# EasyEDA Pro project modular_design_320320LCD.eprj

# Schematic Schematic1

## Sheets
1 P0_MCU_extend: Board Name: Board1; Create Date: 2026-06-22; Page Name: P0_MCU_extend; Project Name: modular_design; Schematic Name: Schematic1; Update Date: 2026-07-06; Add into BOM: yes; Company: 嘉立创EDA; Convert to PCB: yes; Page Size: A4; Version: V1.0
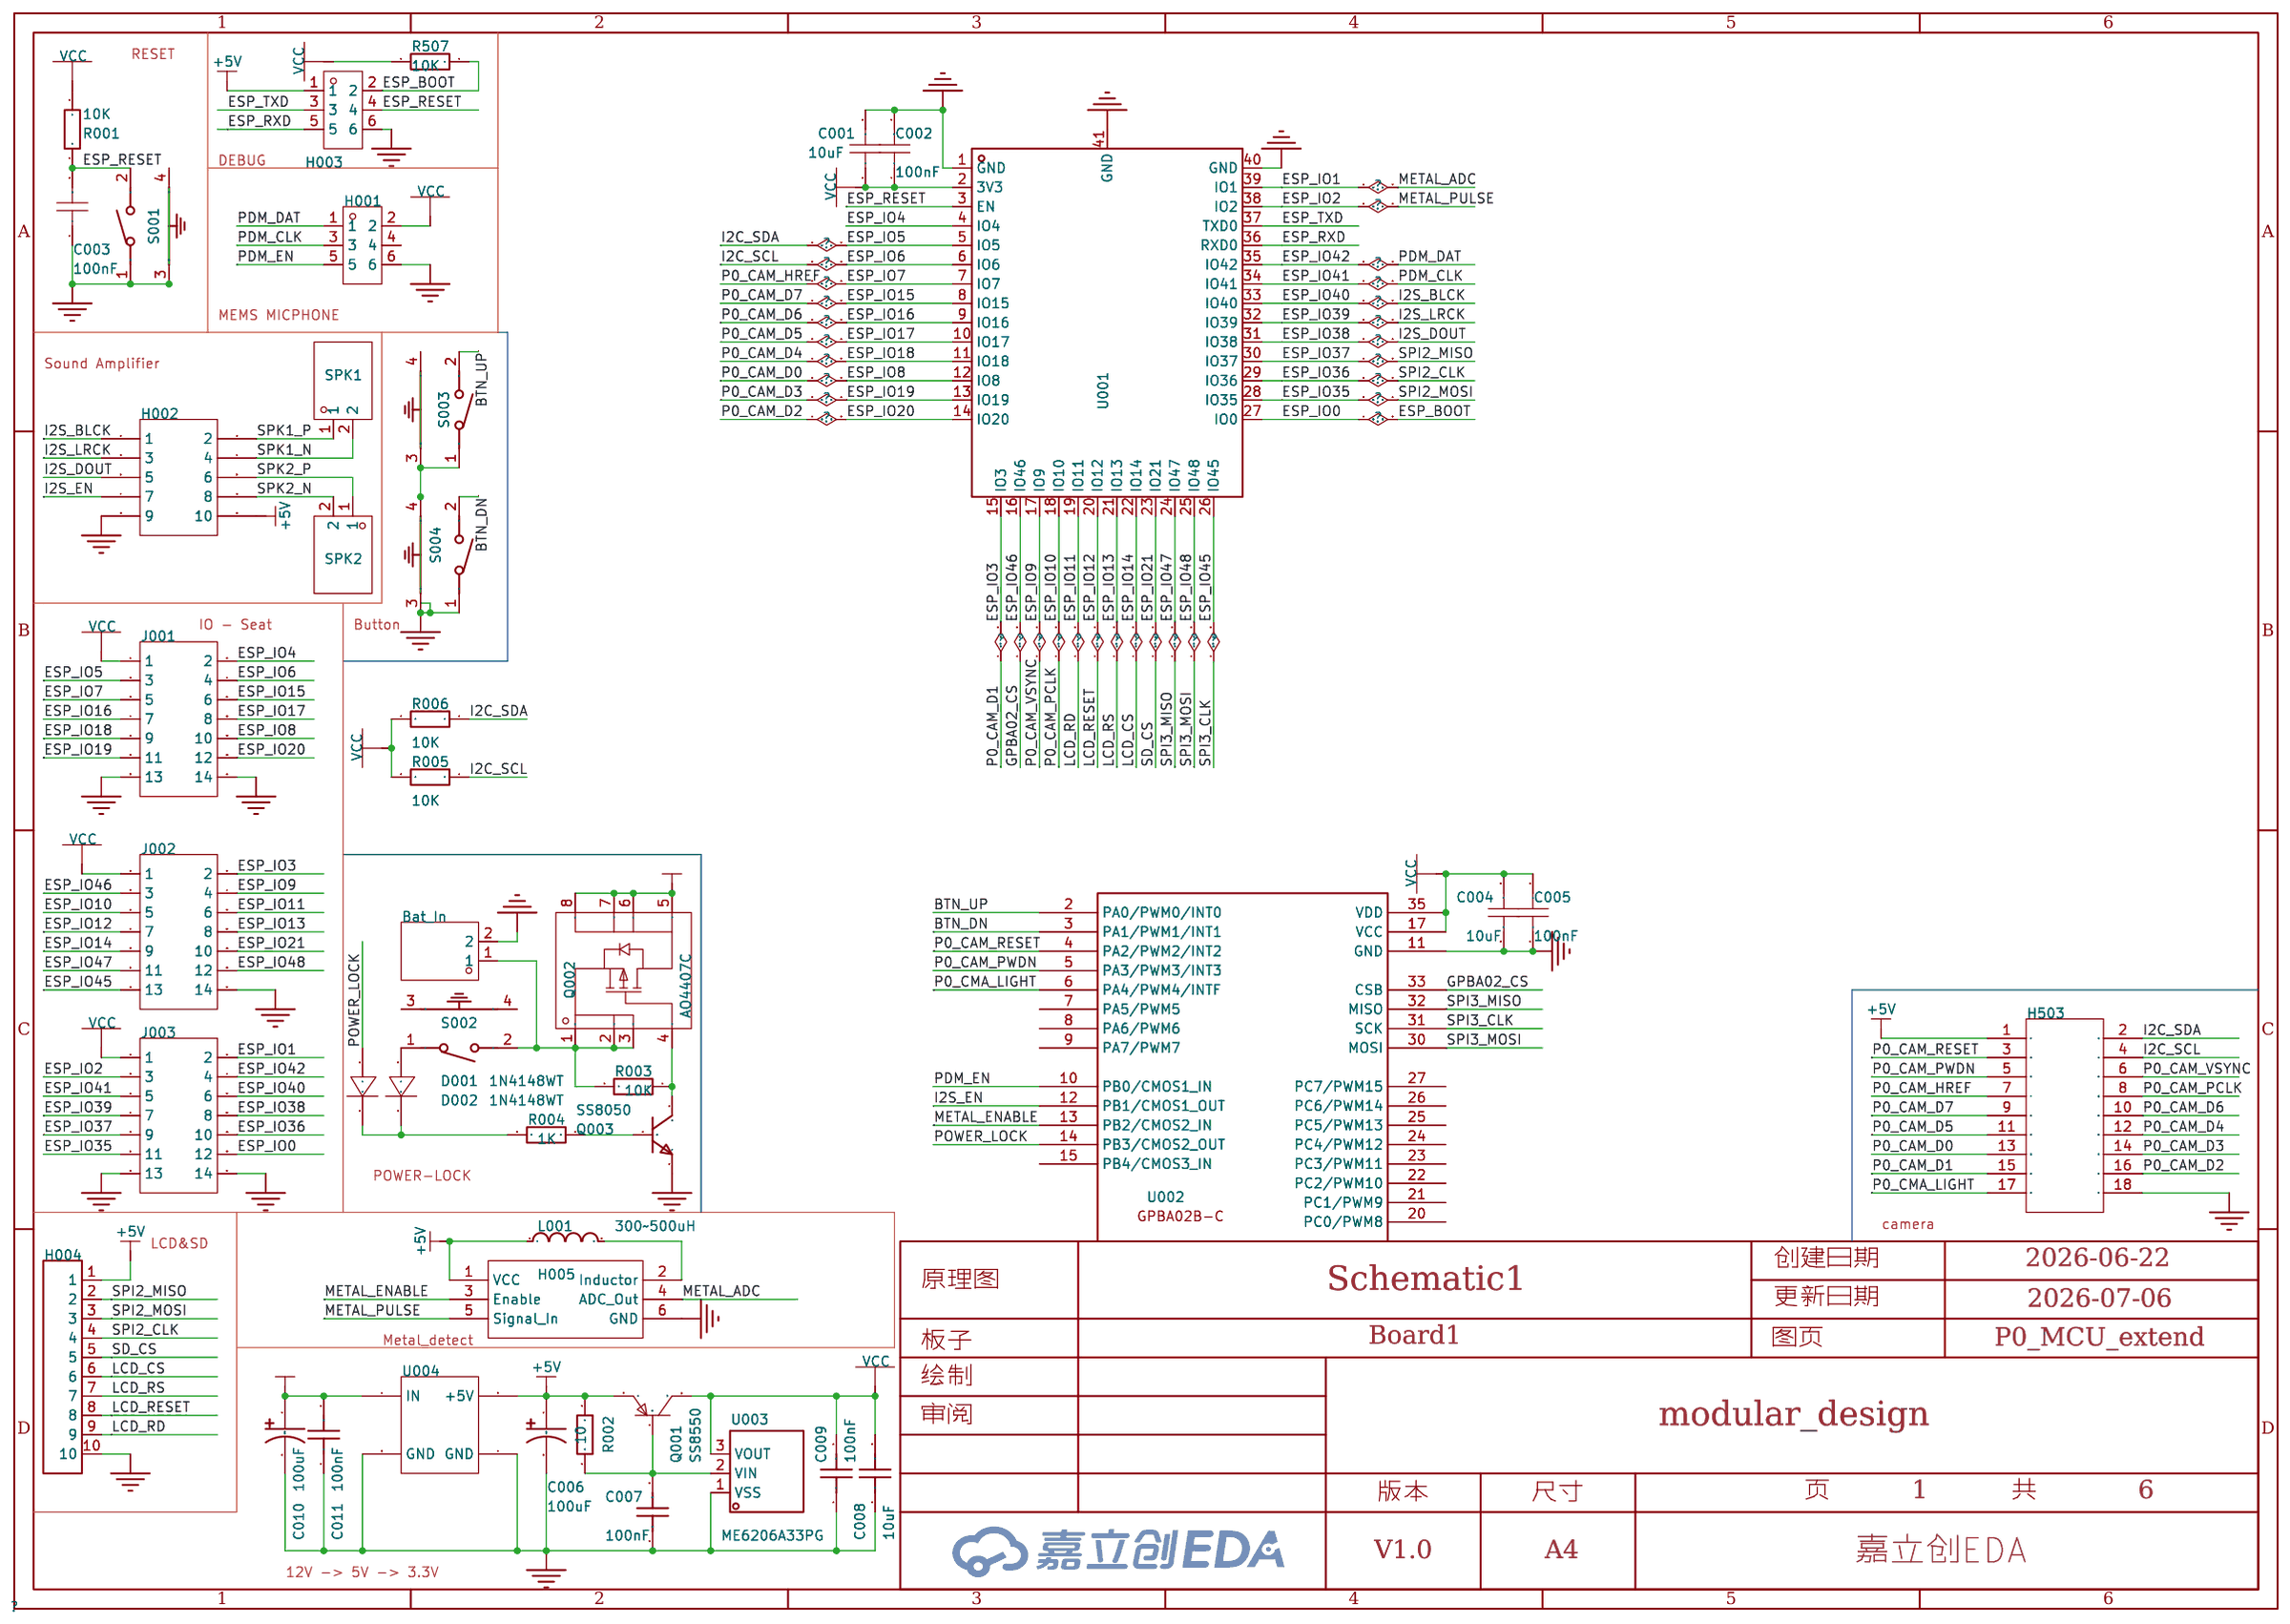
[diagram p0: P0_MCU_extend]
2 P1_mic_amp: Create Date: 2026-06-24; Page Name: P1_mic_amp; Update Date: 2026-06-26
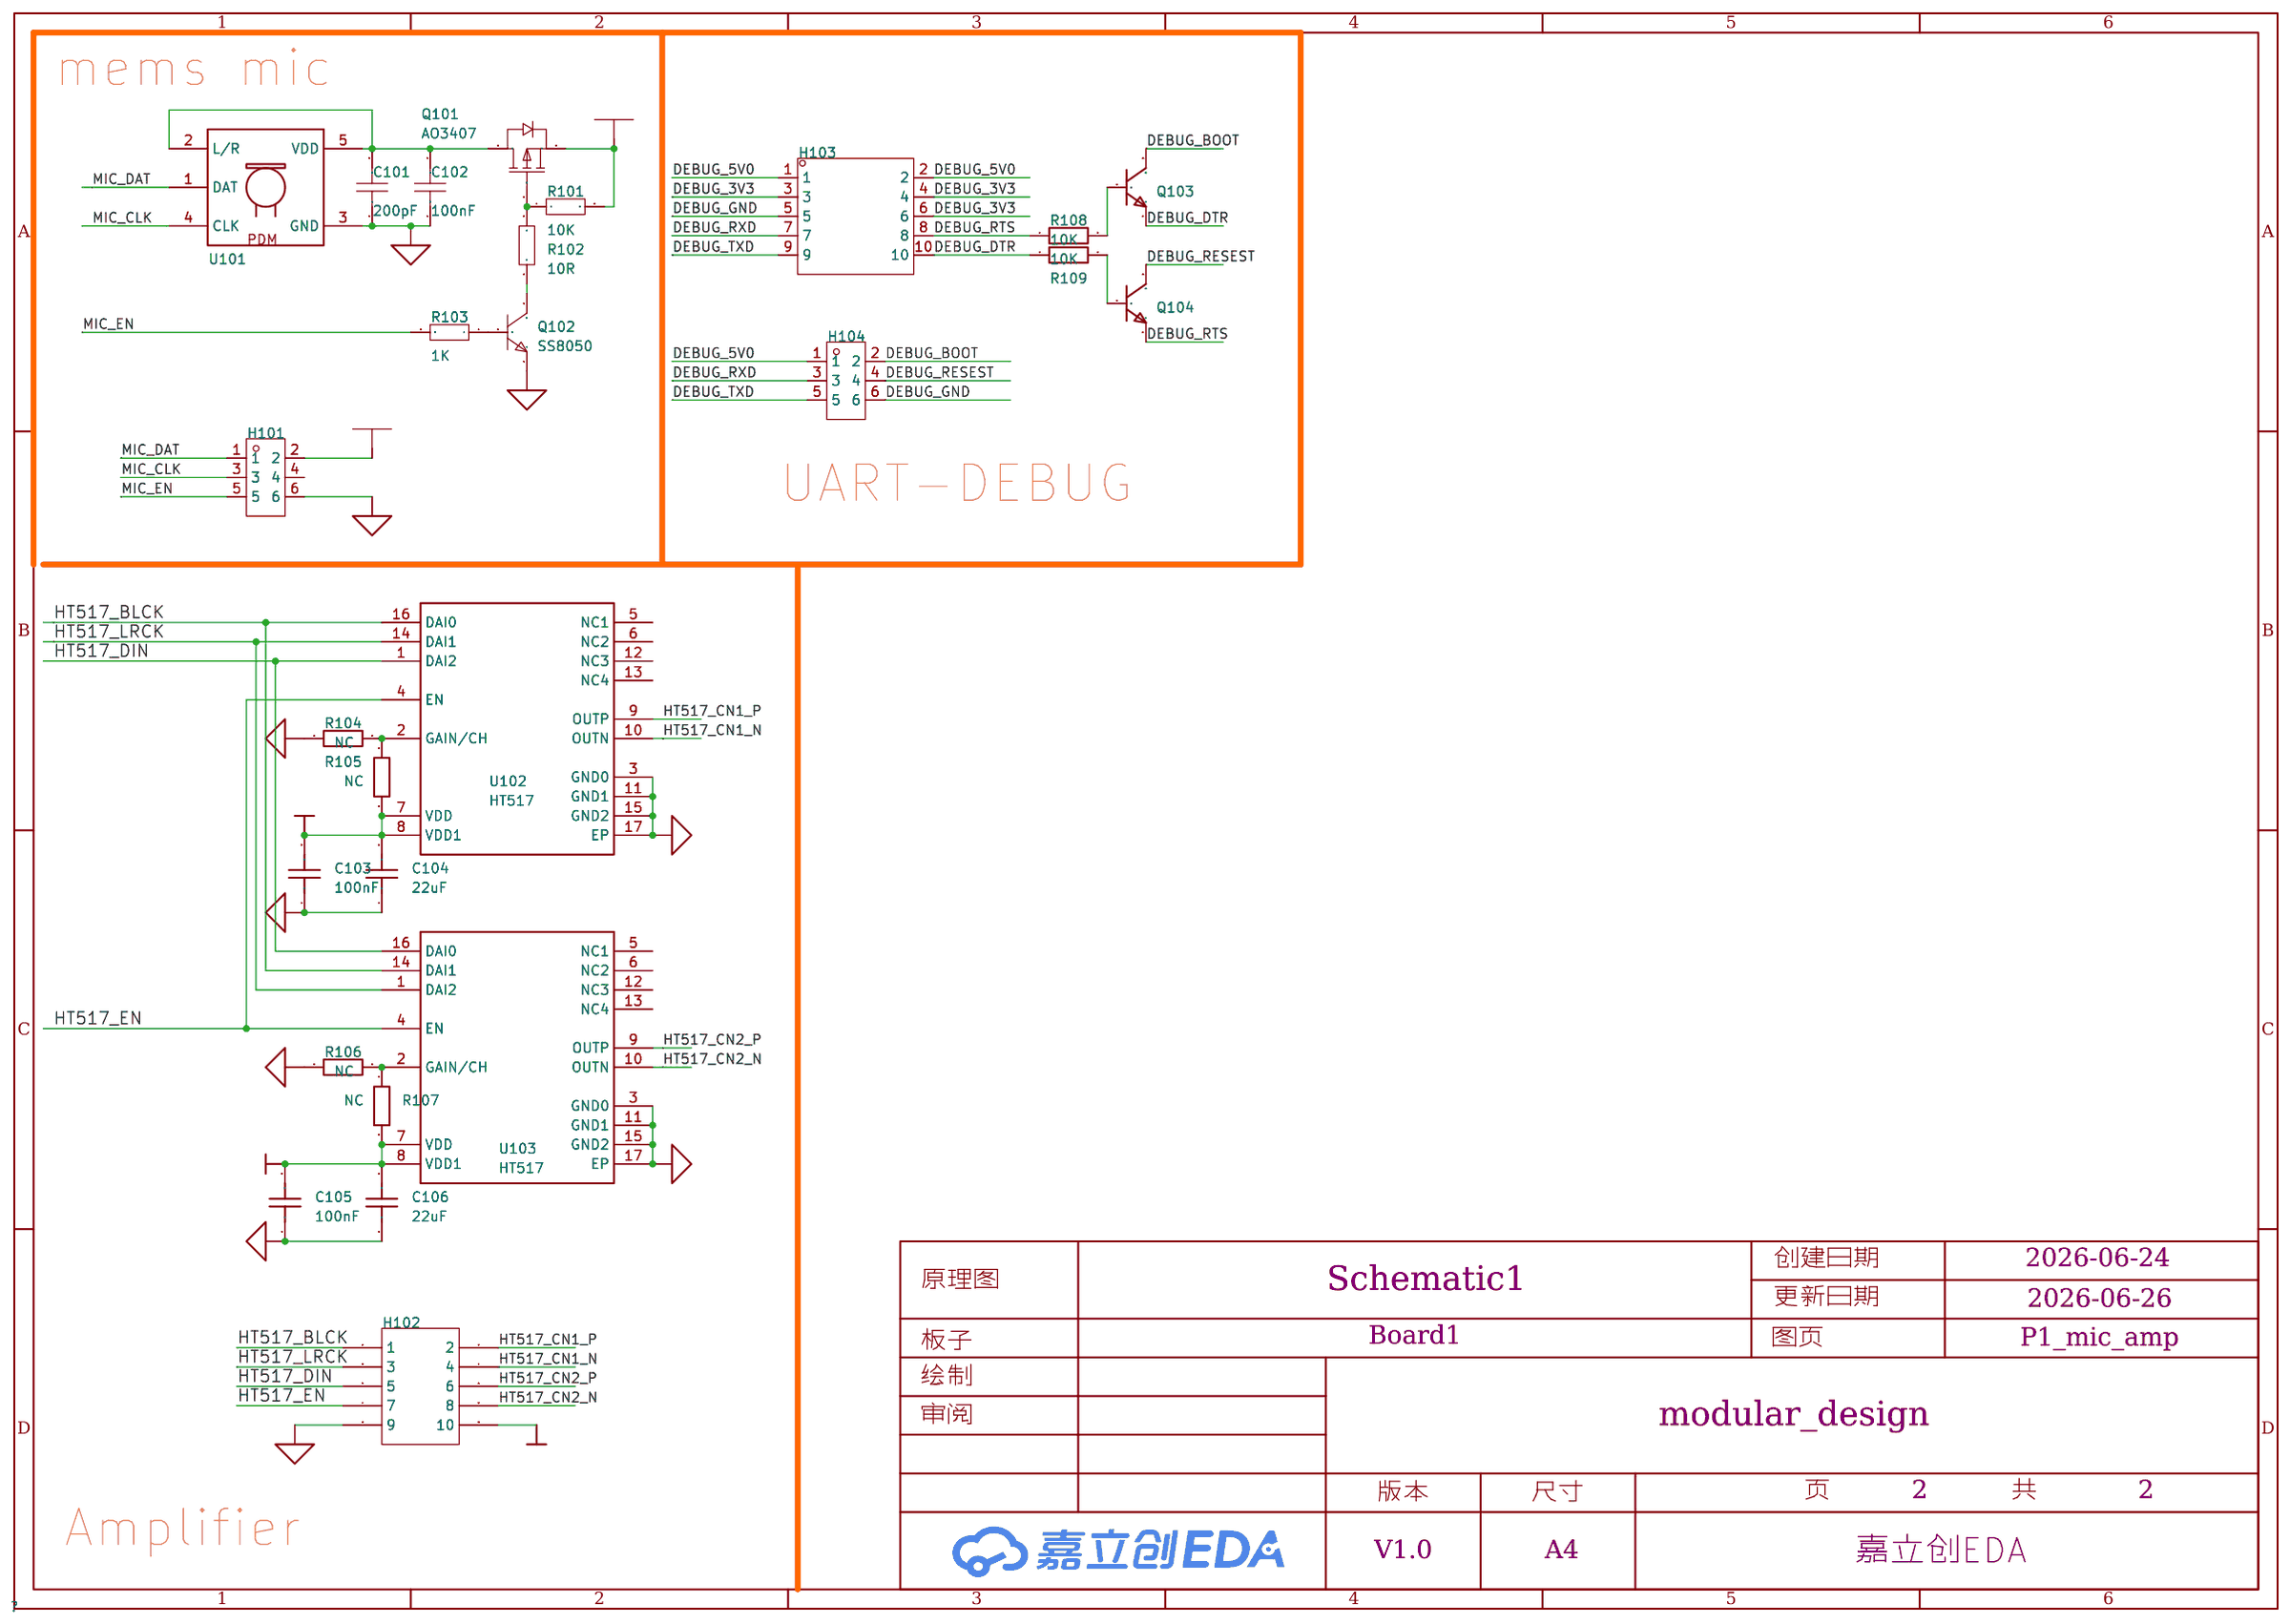
[diagram p1: P1_mic_amp]
3 P2_LCD_SD: Create Date: 2026-06-30; Page Name: P2_LCD_SD
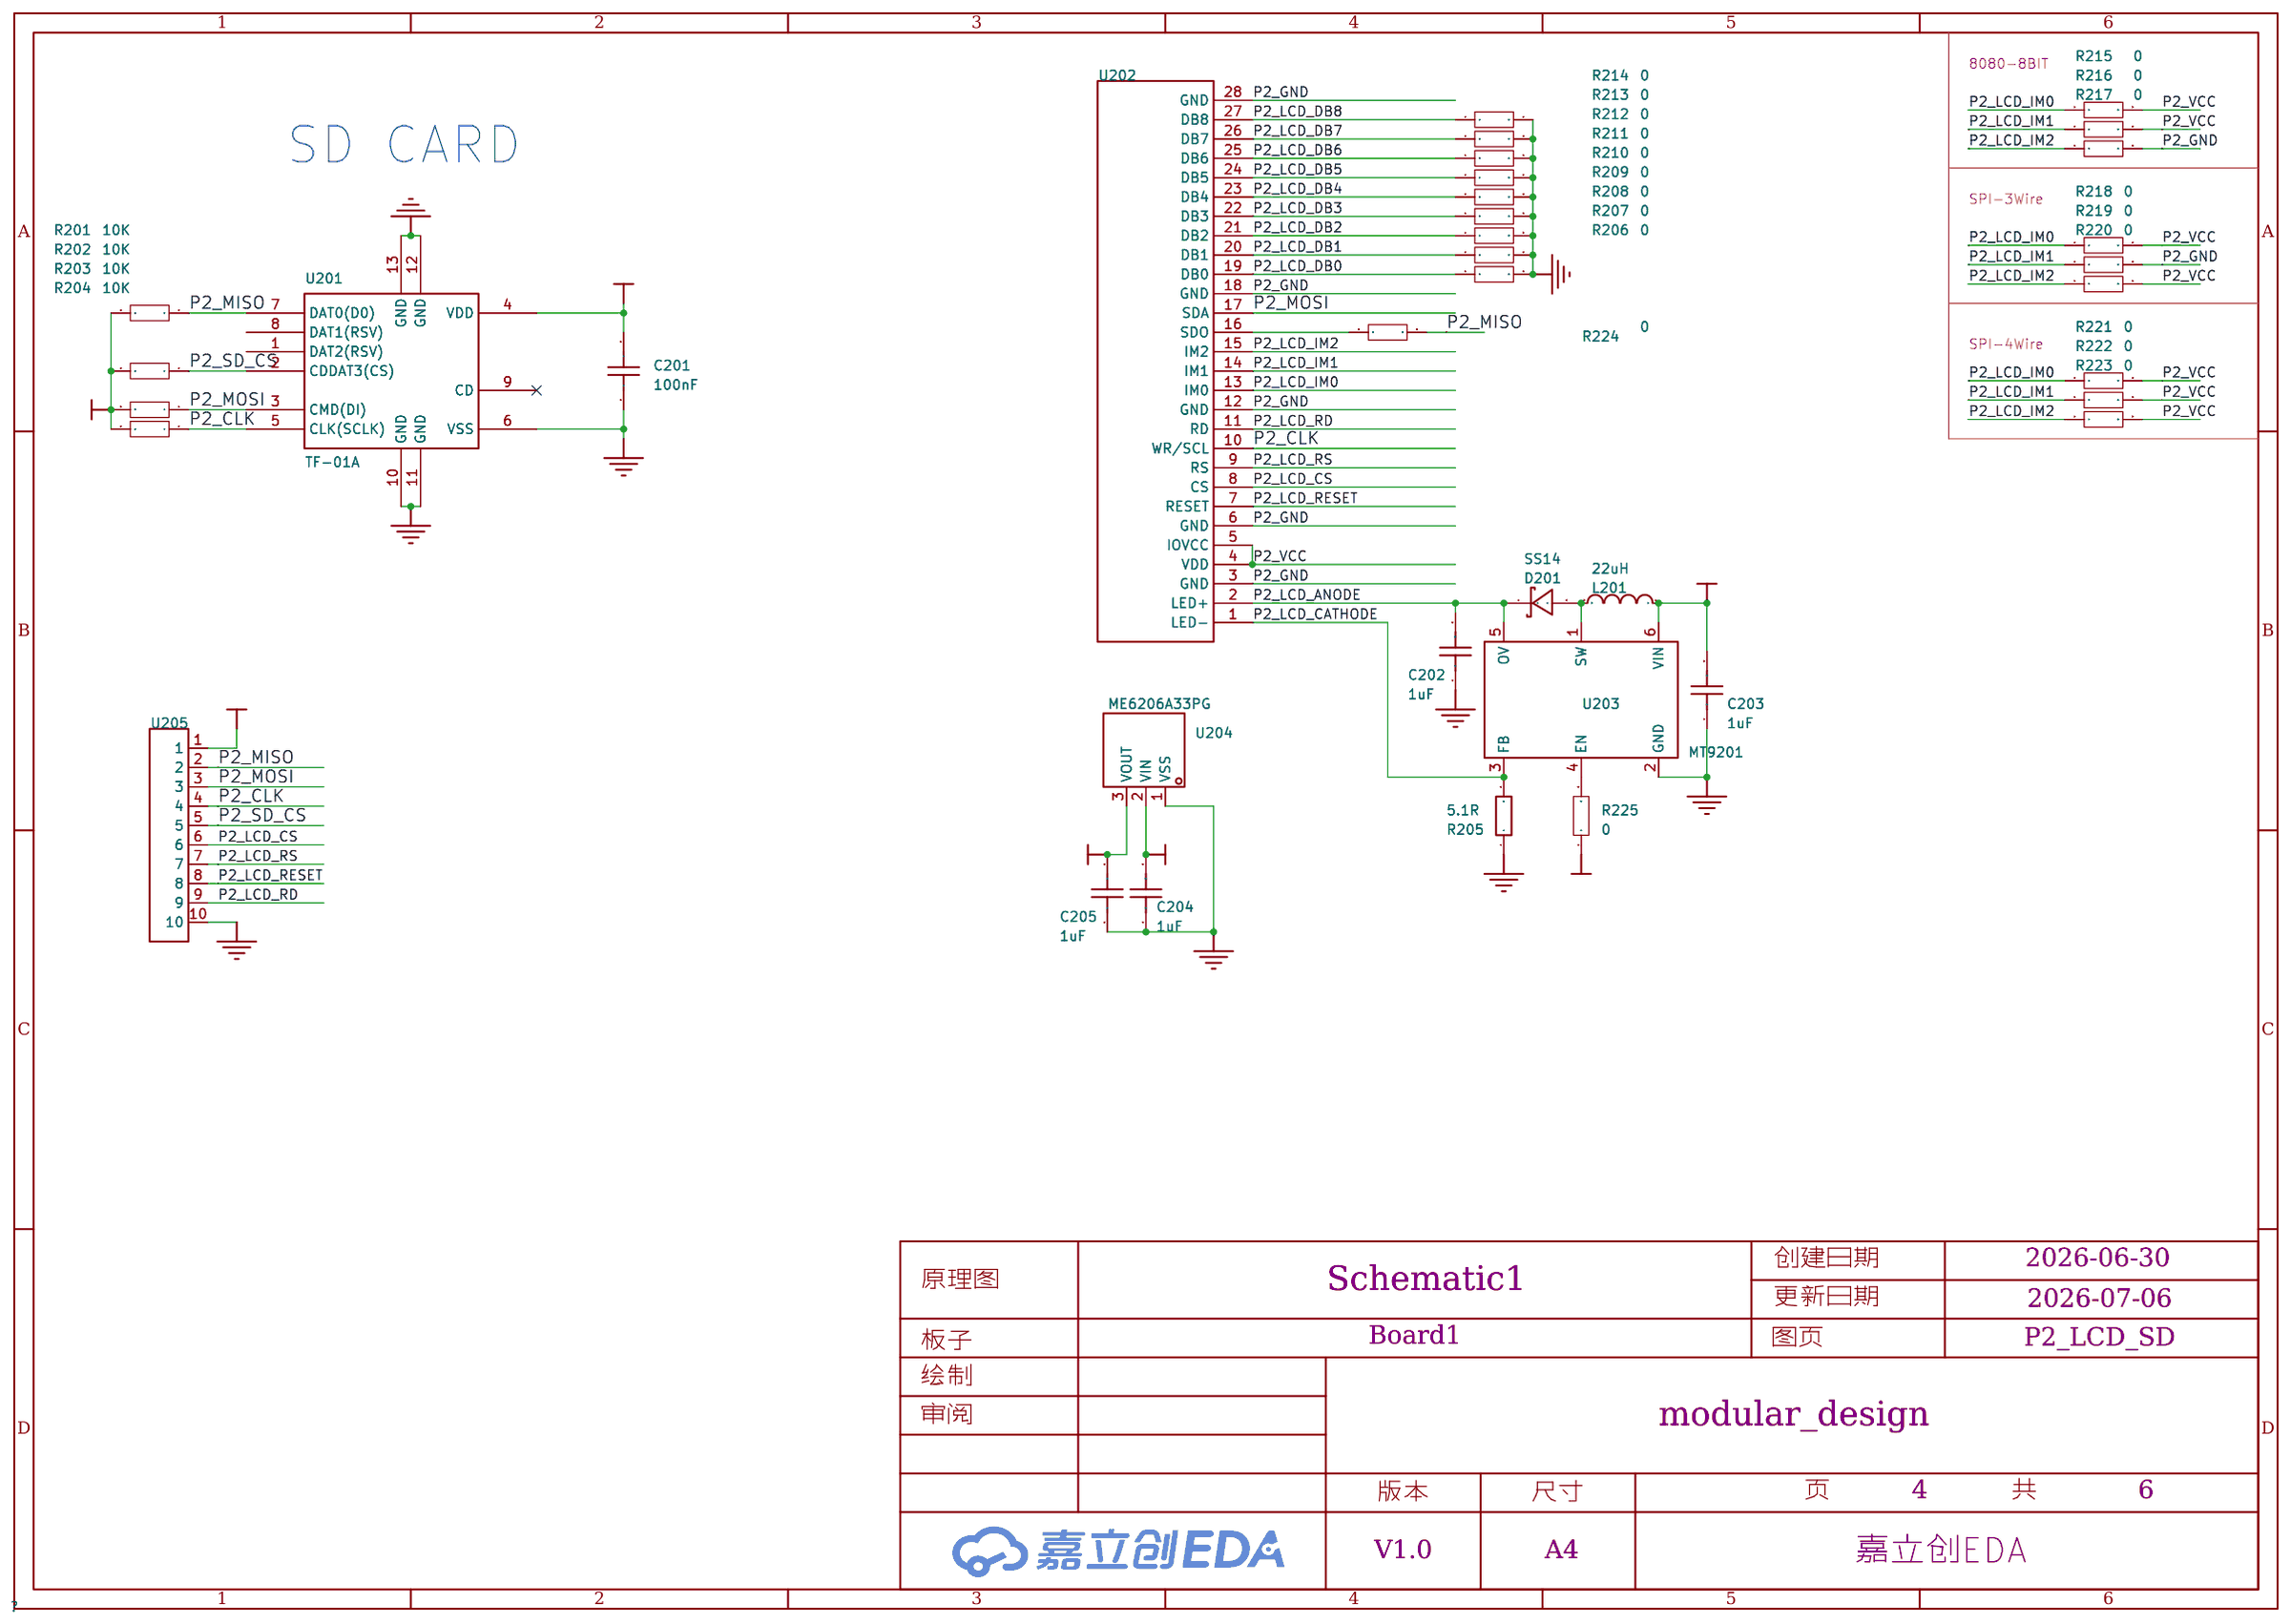
[diagram p2: P2_LCD_SD]
4 P4_metal_detect: Create Date: 2026-07-01; Page Name: P4_metal_detect; Update Date: 2026-07-01
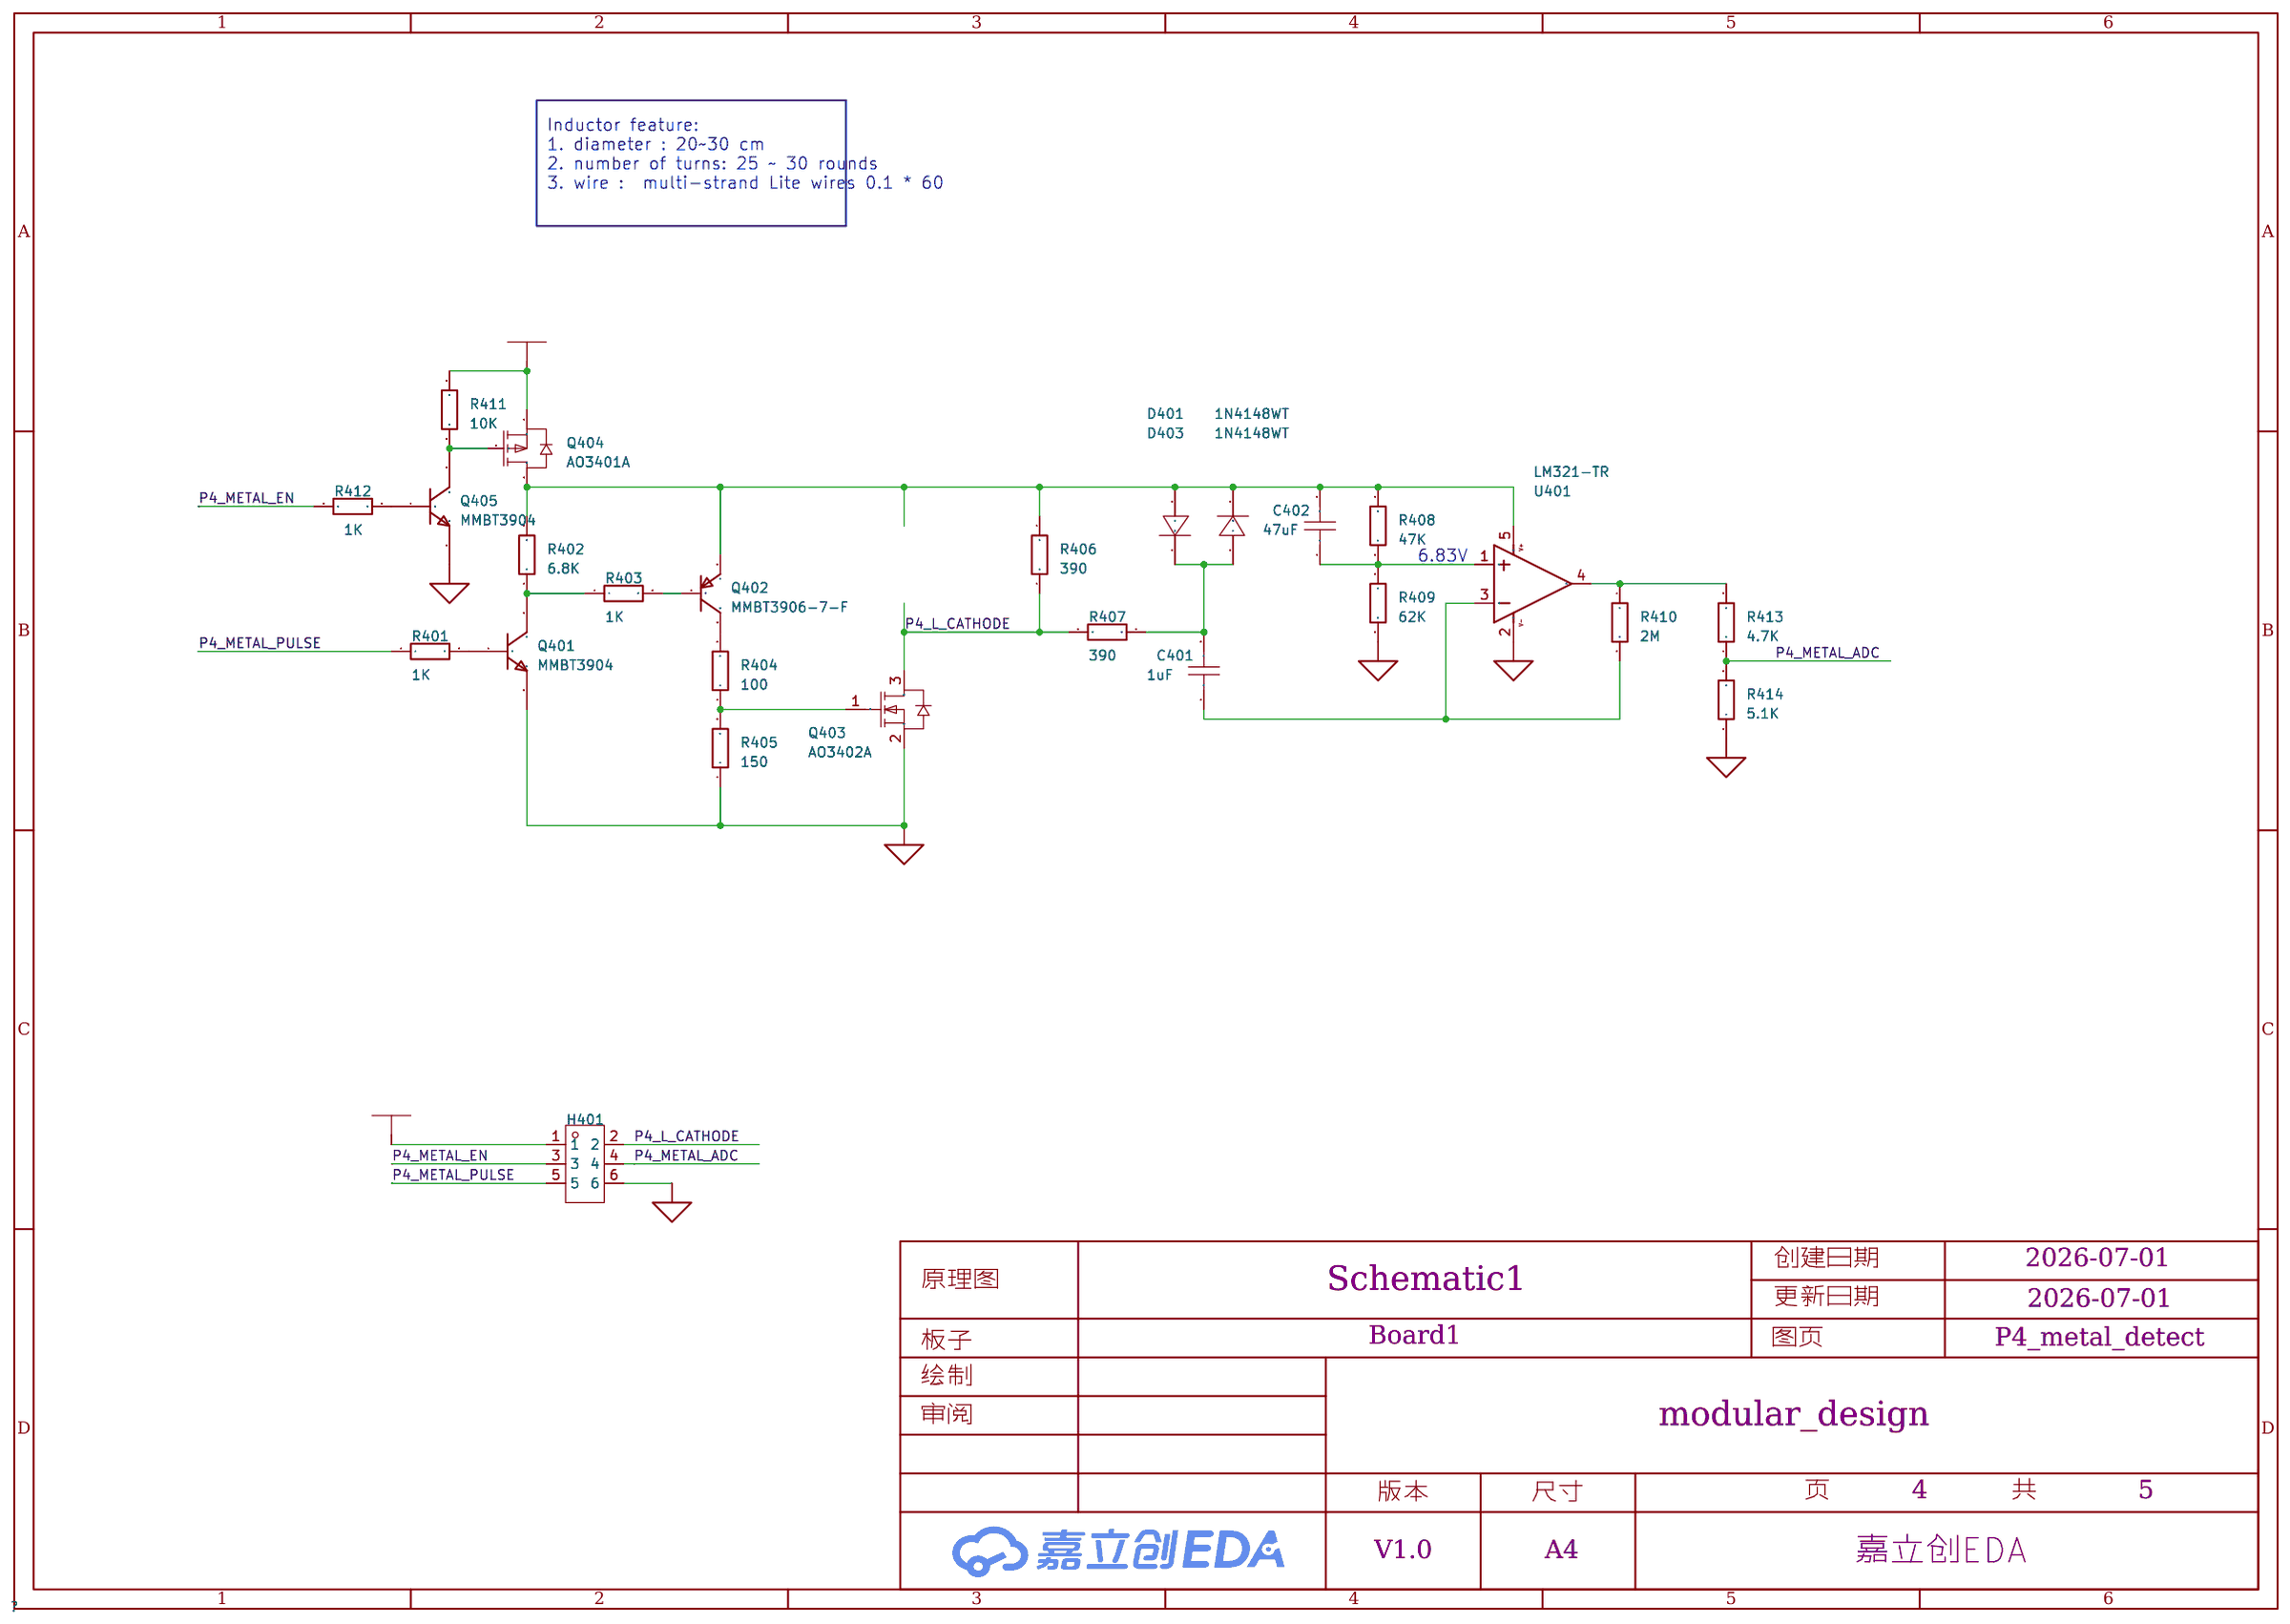
[diagram p3: P4_metal_detect]
5 P3_Charger: Create Date: 2026-07-01; Page Name: P3_Charger; Update Date: 2026-07-01
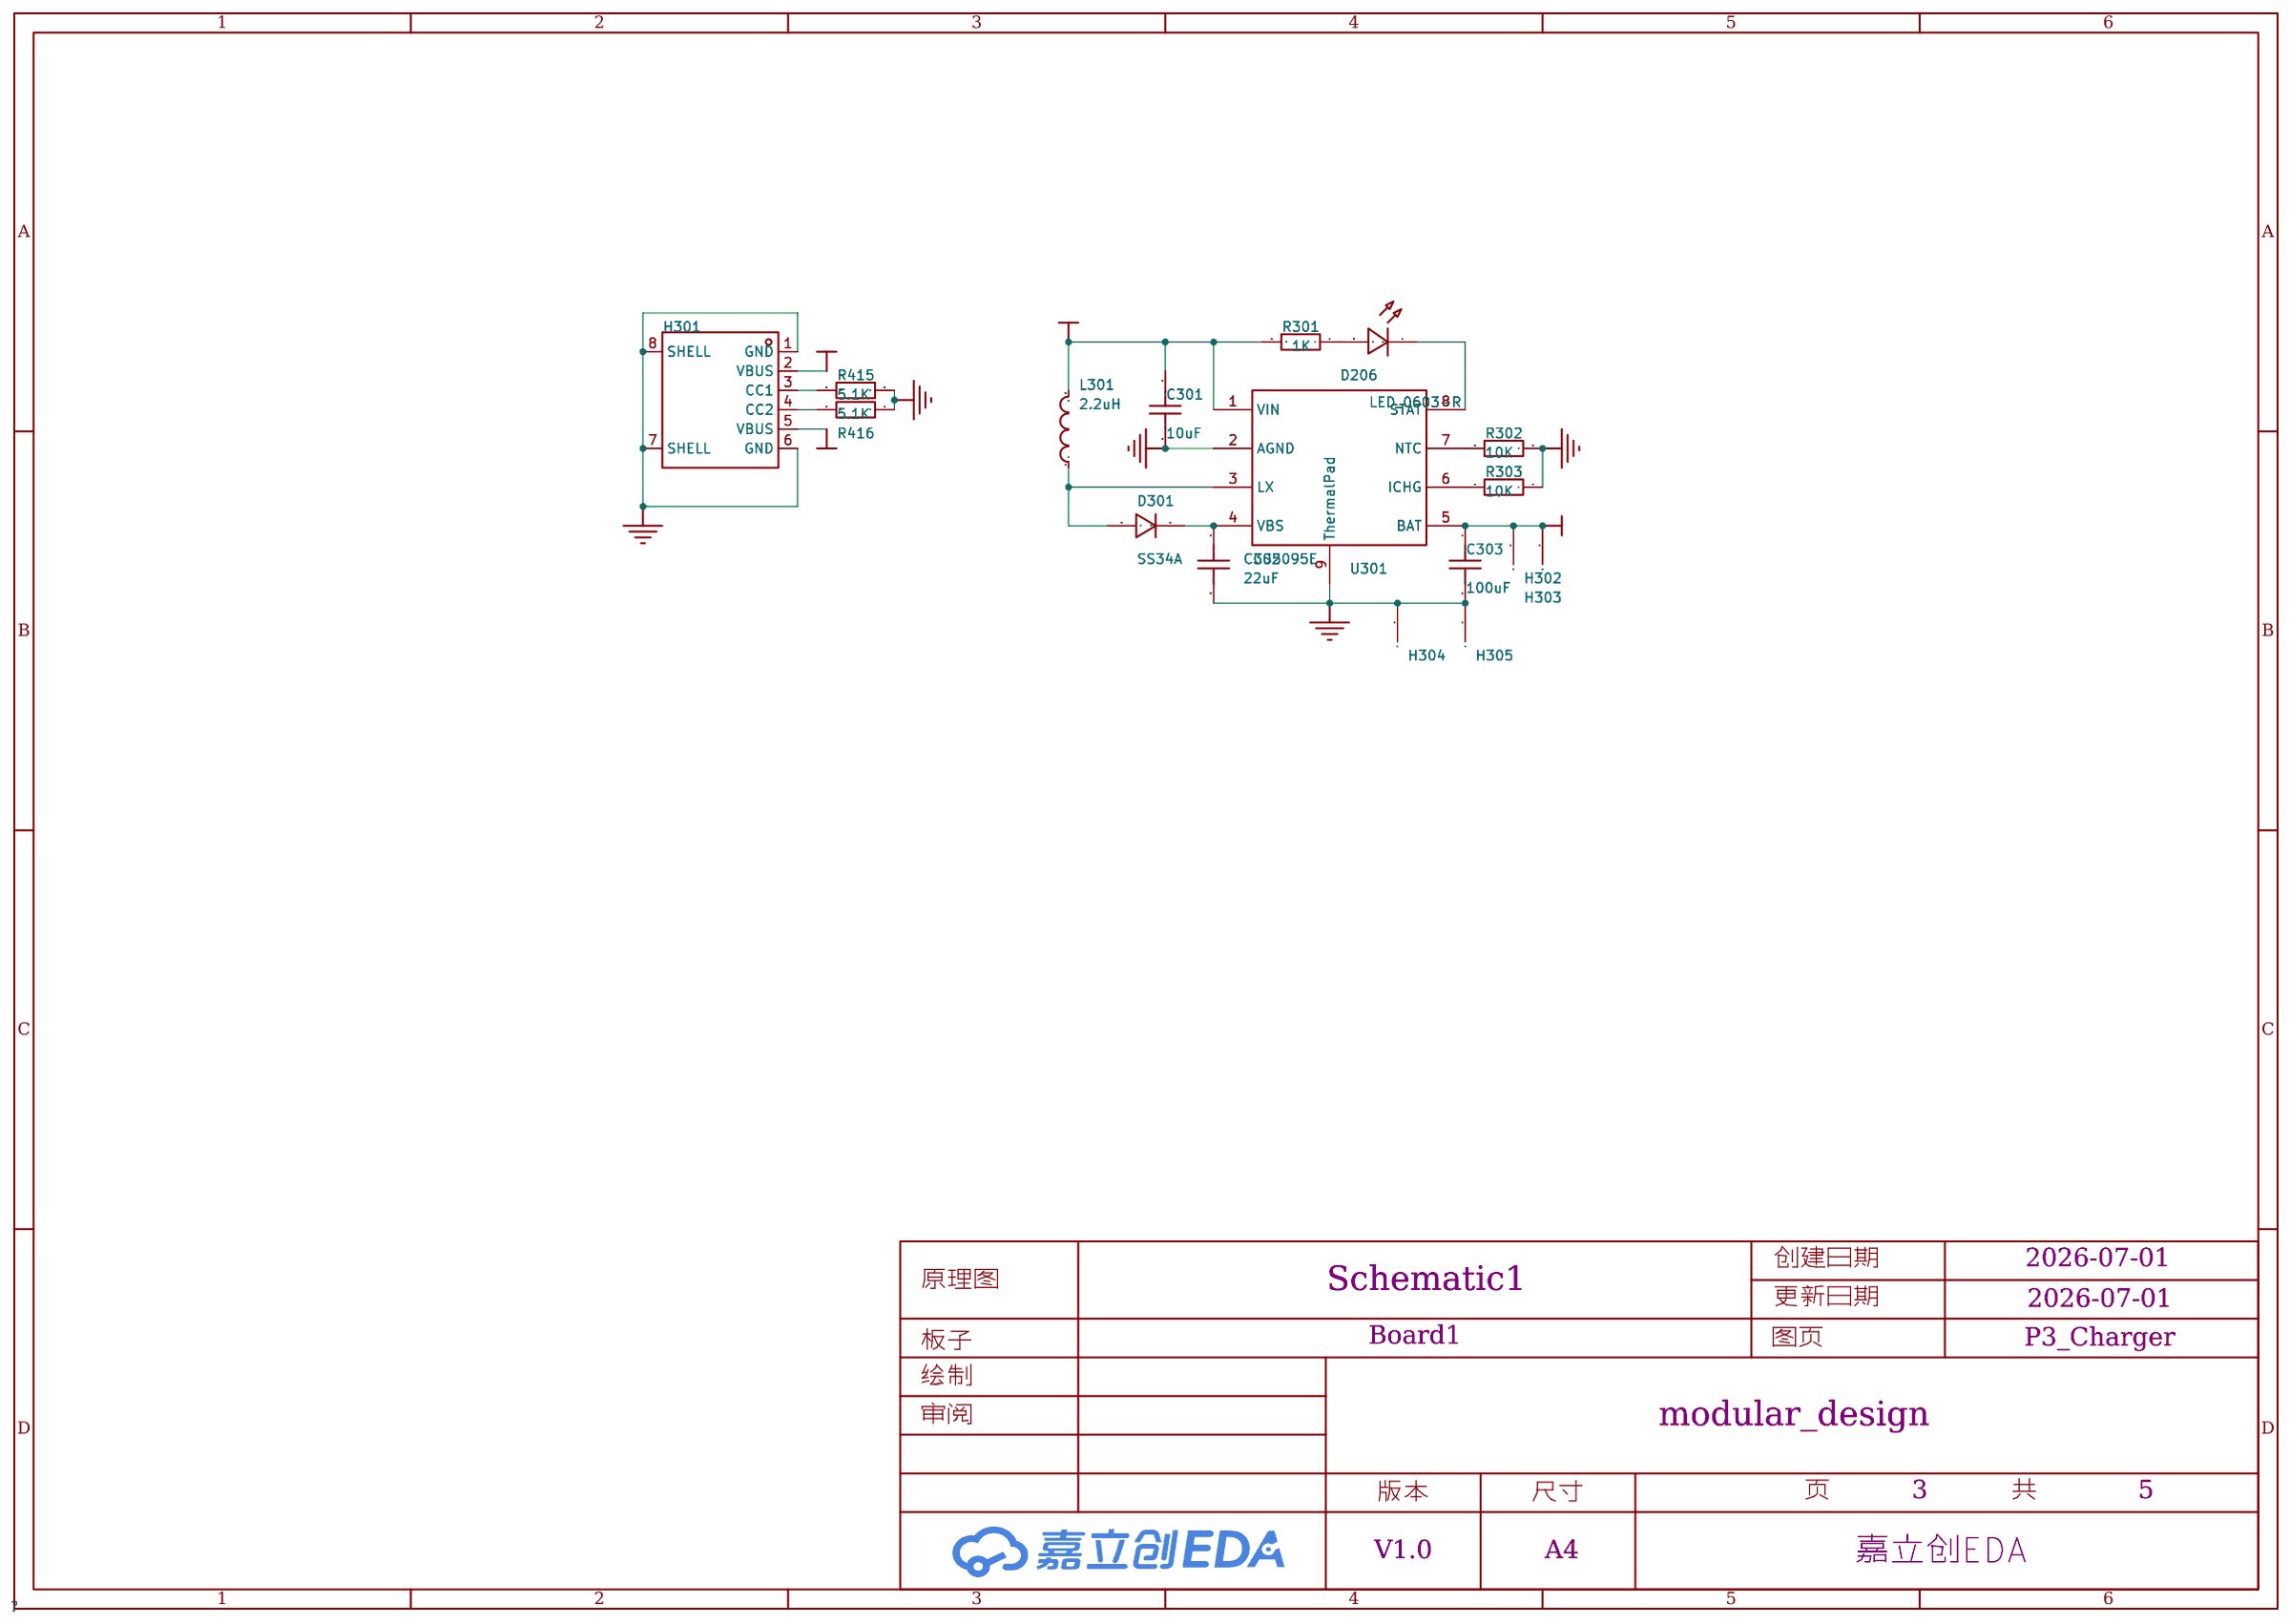
[diagram p4: P3_Charger]
6 P5_camera: Create Date: 2026-07-06; Page Name: P5_camera
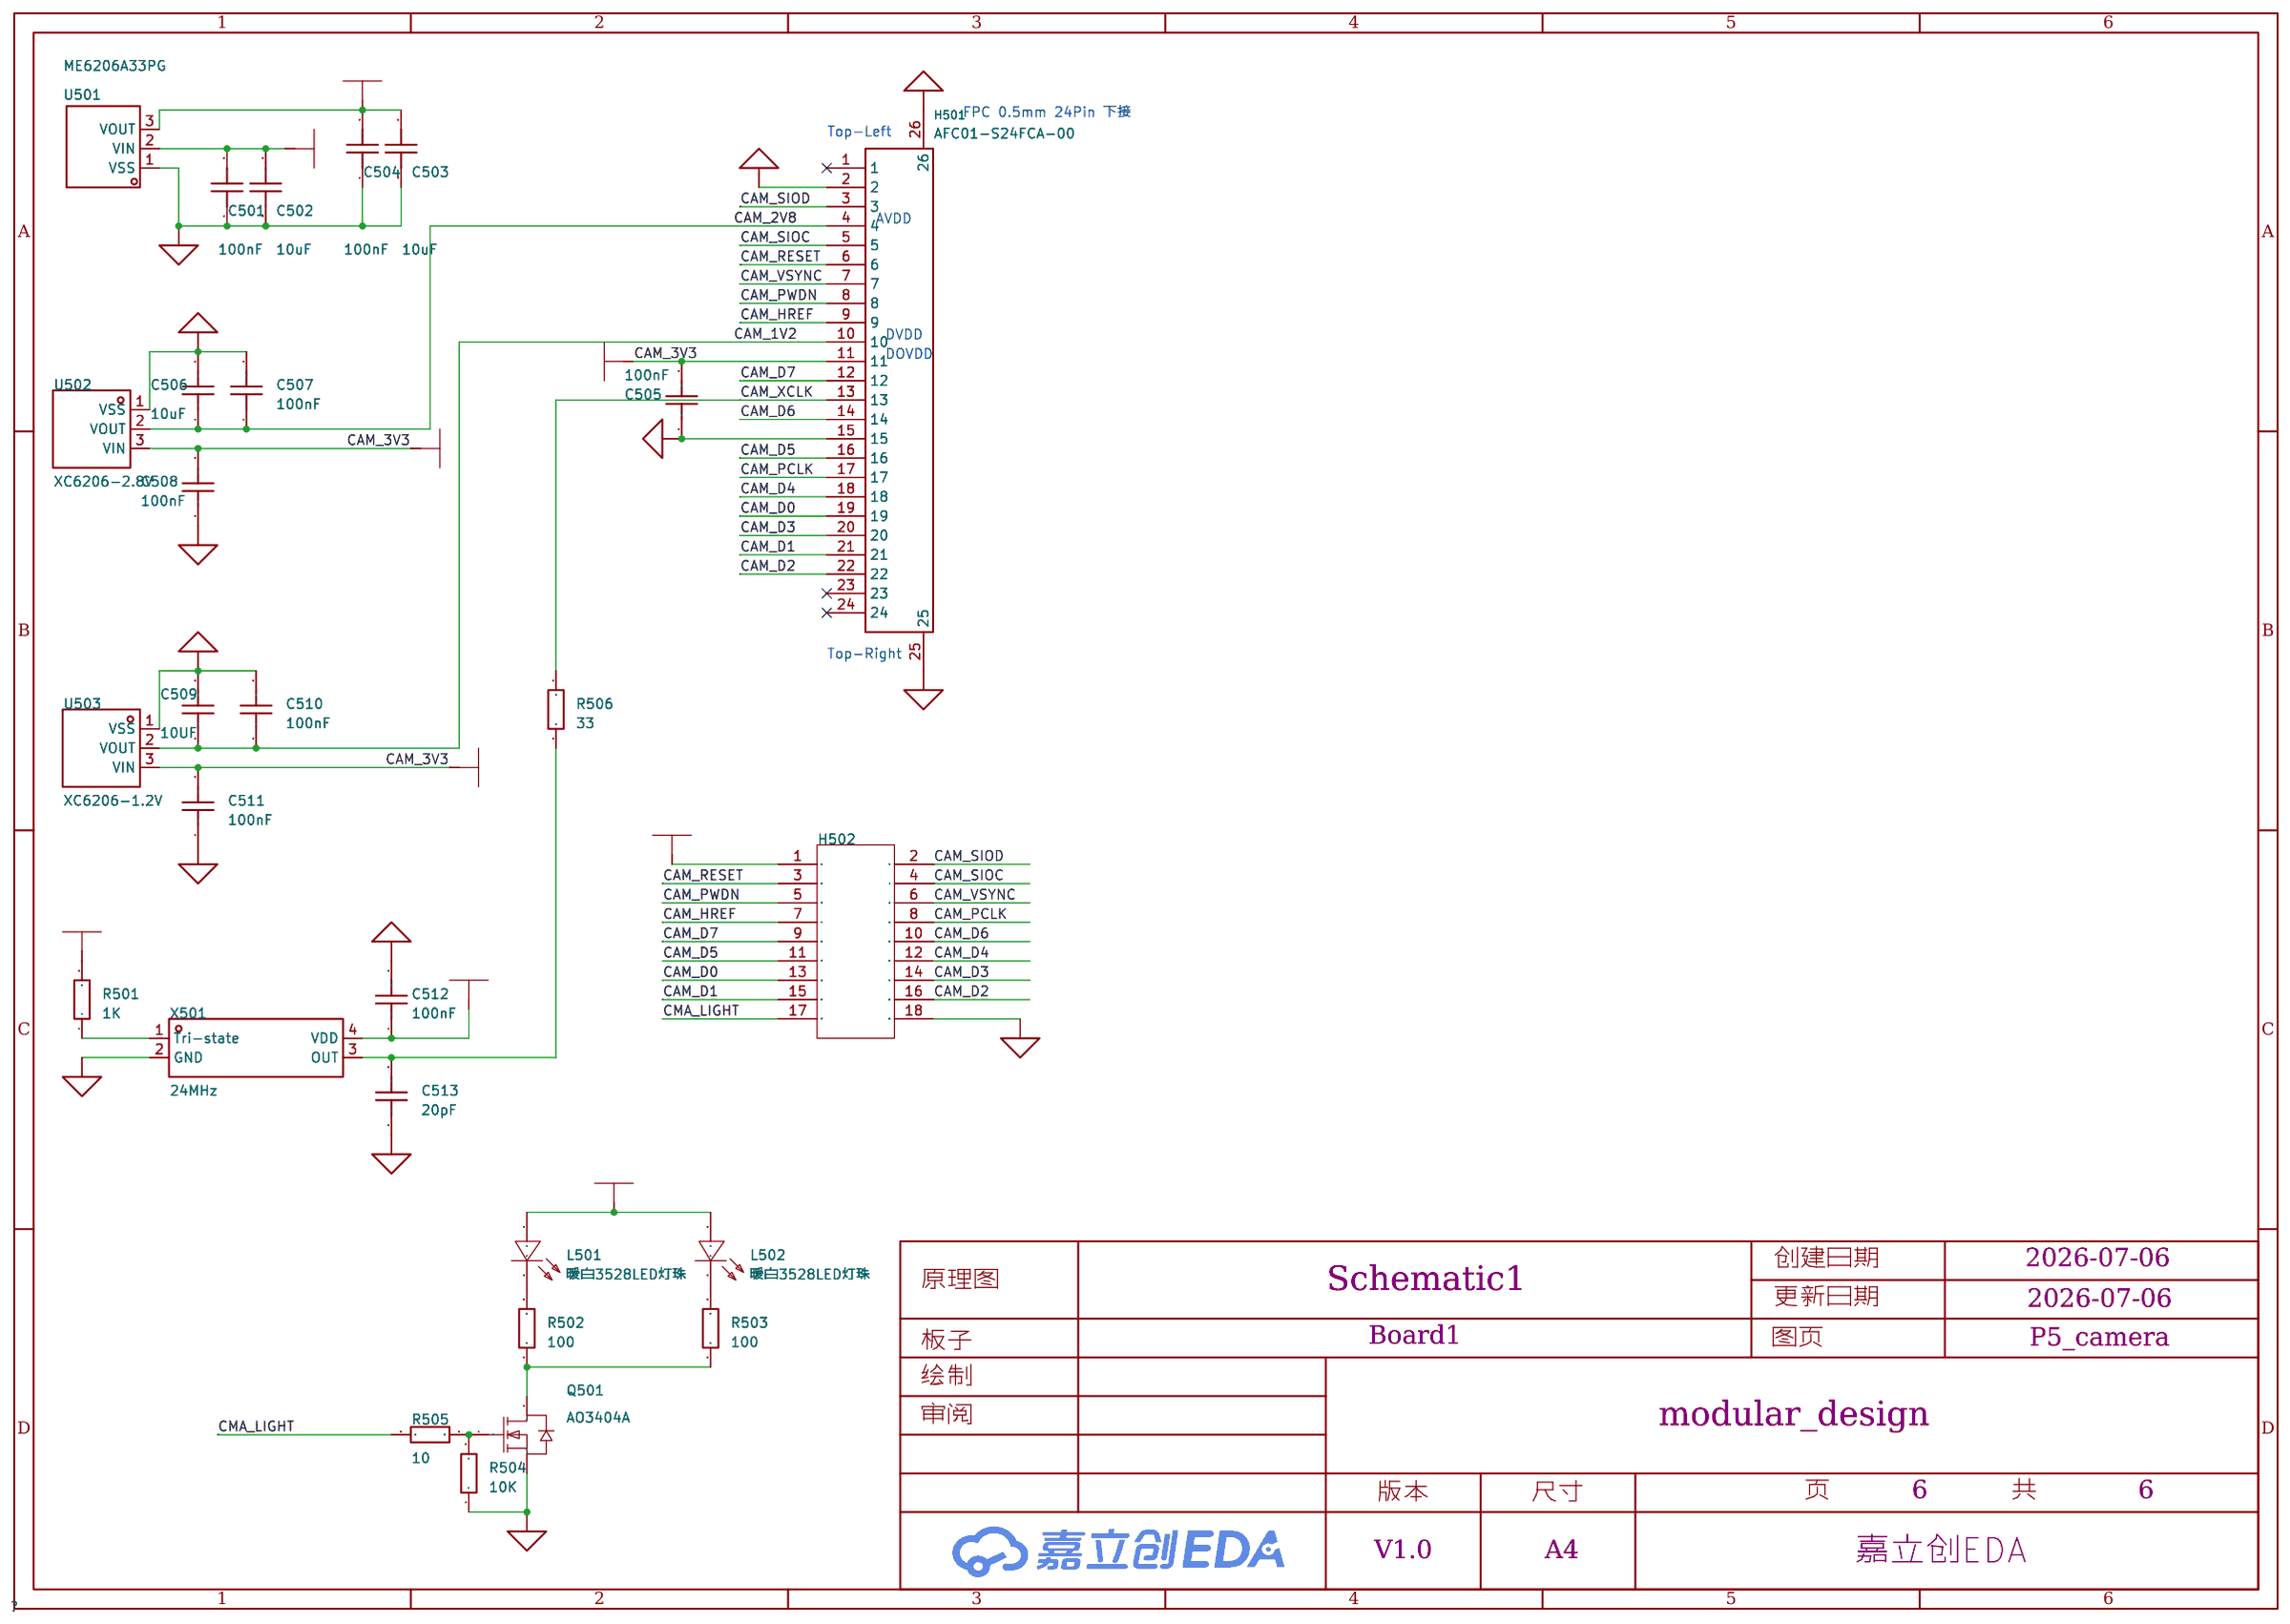
[diagram p5: P5_camera]

## Parts
sheet P0_MCU_extend
Bat_In  B2B-ZR(LF)(SN)  [connector_p2_2.0mm]
C001  10uF  [C0805]
C002  100nF  [C0603]
C003  100nF  [C0603]
C004  10uF  [C0805]
C005  100nF  [C0603]
C006  100uF  [CAP-SMD_BD6.3-L6.6-W6.6-LS7.2-R-RD]
C007  100nF  [C0805]
C008  10uF  [C0805]
C009  100nF  [C0805]
C010  100uF  [CAP-SMD_BD6.3-L6.6-W6.6-LS7.2-R-RD]
C011  100nF  [C0805]
D001  1N4148WT  [SOD-523_L1.2-W0.8-LS1.6-RD]
D002  1N4148WT  [SOD-523_L1.2-W0.8-LS1.6-RD]
H001  PZ254V-12-6P  [PDM_MODULE]
H002  -  [I2S_HT517_STEREO]
H003  PZ254V-12-6P  [CH343_DEBUG]
H004  -  [connector_p10_1.5mm]
H005  -  [Metal_Detect]
H503  -  [connector_p2*9_2.54]
J001  2.54-2*7P母  [HDR-TH_14P-P2.54-V-F-R2-C7-S2.54-1]
J002  2.54-2*7P母  [HDR-TH_14P-P2.54-V-F-R2-C7-S2.54-1]
J003  2.54-2*7P母  [HDR-TH_14P-P2.54-V-F-R2-C7-S2.54-1]
L001  470uH  [connector_p2_2.0mm]
Q001  SS8550  [SOT-23-3_L2.9-W1.4-P1.90-LS2.6-BR]
Q002  AO4407C  [SOP-8_L4.9-W3.9-P1.27-LS6.0-BL]
Q003  SS8050  [SOT-23-3_L2.9-W1.3-P1.90-LS2.4-BR]
R001  10K  [R0603]
R002  10K  [R0603]
R003  10K  [R0603]
R004  10K  [R0603]
R005  10K  [R0603]
R006  10K  [R0603]
R507  10K  [R0603]
S001  TC-1102N-C-A-B  [SW-TH_TC-1102N-C-A-B]
S002  TC-1102N-C-A-B  [SW-TH_TC-1102N-C-A-B]
S003  TC-1102N-C-A-B  [SW-TH_TC-1102N-C-A-B]
S004  TC-1102N-C-A-B  [SW-TH_TC-1102N-C-A-B]
SPK1  B2B-ZR(LF)(SN)  [CONN-TH_B2B-ZR-LF-SN]
SPK2  B2B-ZR(LF)(SN)  [CONN-TH_B2B-ZR-LF-SN]
U001  -  [ESP32-S3-WROOM-1U]
U002  -  [GPBA02B-C]
U003  ME6206A33PG  [SOT-89-3_L4.5-W2.5-P1.50-LS4.2-BR]
U004  -  [CX8823_MO]
sheet P1_mic_amp
C101  100nF  [C0603]
C102  100nF  [C0603]
C103  100nF  [C0805]
C104  100nF  [C0805]
C105  100nF  [C0805]
C106  100nF  [C0805]
H101  PZ254V-12-6P  [Finger_2*3]
H102  -  [Finger_2*5]
H103  MTP125-1205S1  [HDR-TH_10P-P2.54-V-M-R2-C5-S2.54]
H104  PZ254V-12-6P  [Finger_2*3]
Q101  AO3407  [SOT-23-3_L2.9-W1.3-P1.90-LS2.4-BR]
Q102  SS8050  [SOT-23-3_L2.9-W1.3-P1.90-LS2.4-BR]
Q103  SS8050  [SOT-23-3_L2.9-W1.3-P1.90-LS2.4-BR]
Q104  SS8050  [SOT-23-3_L2.9-W1.3-P1.90-LS2.4-BR]
R101  10K  [R0603]
R102  10R  [R0603]
R103  1K  [R0603]
R104  NC  [R0603]
R105  NC  [R0603]
R106  NC  [R0603]
R107  NC  [R0603]
R108  NC  [R0603]
R109  NC  [R0603]
U101  -  [SD18OB261-104]
U102  HT517  [QFN-16_L3.0-W3.0-P0.50-TL-EP1.7]
U103  HT517  [QFN-16_L3.0-W3.0-P0.50-TL-EP1.7]
sheet P2_LCD_SD
C201  100nF  [C0805]
C202  100nF  [C0805]
C203  100nF  [C0805]
C204  100nF  [C0603]
C205  100nF  [C0603]
D201  SS14  [SMA_L4.3-W2.6-LS5.2-RD]
L201  22uH  [IND-SMD_L4.0-W4.0]
R201  10K  [R0603]
R202  10K  [R0603]
R203  10K  [R0603]
R204  10K  [R0603]
R205  10K  [R0603]
R206  10K  [R0603]
R207  10K  [R0603]
R208  10K  [R0603]
R209  10K  [R0603]
R210  10K  [R0603]
R211  10K  [R0603]
R212  10K  [R0603]
R213  10K  [R0603]
R214  10K  [R0603]
R215  10K  [R0603]
R216  10K  [R0603]
R217  10K  [R0603]
R218  10K  [R0603]
R219  10K  [R0603]
R220  10K  [R0603]
R221  10K  [R0603]
R222  10K  [R0603]
R223  10K  [R0603]
R224  10K  [R0603]
R225  10K  [R0603]
U201  TF-01A  [TF-SMD_TF-01A]
U202  -  [FPC_28P_0.5]
U203  MT9201  [SOT-23-6_L2.9-W1.6-P0.95-LS2.8-BR]
U204  ME6206A33PG  [SOT-89-3_L4.5-W2.5-P1.50-LS4.2-BR]
U205  -  [connector_p10_1.5mm]
sheet P3_Charger
C301  10uF  [C0805]
C302  22uF  [C0805]
C303  100uF  [C0805]
D206  LED_0603-R  [LED_0603]
D301  SS34A  [SMA_L4.3-W2.6-LS5.2-RD]
H301  -  [typec-31-e-11]
H302  -  [Single_Pin]
H303  -  [Single_Pin]
H304  -  [Single_Pin]
H305  -  [Single_Pin]
L301  4.7uH  [IND-SMD_L5.8-W5.2]
R301  1K  [R0603]
R302  10K  [R0603]
R303  10K  [R0603]
R415  10K  [R0603]
R416  10K  [R0603]
U301  CS5095E  [ESOP-8_L4.9-W3.9-P1.27-LS6.0-BL-EP]
sheet P4_metal_detect
C401  1uF  [C0603]
C402  1uF  [C0805]
D401  1N4148WT  [SOD-523_L1.2-W0.8-LS1.6-RD]
D403  1N4148WT  [SOD-523_L1.2-W0.8-LS1.6-RD]
H401  PZ254V-12-6P  [Finger_2*3]
Q401  MMBT3904  [SOT-23-3_L2.9-W1.3-P1.90-LS2.4-BR]
Q402  MMBT3906-7-F  [SOT-23-3_L2.9-W1.6-P1.90-LS2.8-BR]
Q403  AO3402A  [SOT-23-3_L2.9-W1.3-P1.90-LS2.4-BR]
Q404  AO3401A  [SOT-23_L2.9-W1.3-P1.90-LS2.4-BR]
Q405  MMBT3904  [SOT-23-3_L2.9-W1.3-P1.90-LS2.4-BR]
R401  10K  [R0603]
R402  10K  [R0603]
R403  10K  [R0603]
R404  10K  [R0603]
R405  10K  [R0603]
R406  10K  [R0603]
R407  10K  [R0603]
R408  10K  [R0603]
R409  10K  [R0603]
R410  10K  [R0603]
R411  10K  [R0603]
R412  10K  [R0603]
R413  10K  [R0603]
R414  10K  [R0603]
U401  LM321-TR  [SOT-23-5_L3.0-W1.7-P0.95-LS2.8-BR]
sheet P5_camera
C501  100nF  [C0603]
C502  10uF  [C0603]
C503  10uF  [C0603]
C504  100nF  [C0603]
C505  0.1UF  [C0603]
C506  10UF  [C0603]
C507  0.1UF  [C0603]
C508  0.1UF  [C0603]
C509  10UF  [C0603]
C510  0.1UF  [C0603]
C511  0.1UF  [C0603]
C512  100nF  [C0603]
C513  20pF  [C0603]
H501  AFC01-S24FCA-00  [FPC-SMD_P0.50-24P_FGS-XJ-H2.0]
H502  -  [Finger_2*9]
L501  暖白3528LED灯珠  [LED-SMD_L3.6-W2.9-R-RD]
L502  暖白3528LED灯珠  [LED-SMD_L3.6-W2.9-R-RD]
Q501  AO3404A  [SOT-23_L2.9-W1.3-P1.90-LS2.4-BR]
R501  1K  [R0603]
R502  1K  [R0603]
R503  1K  [R0603]
R504  1K  [R0603]
R505  1K  [R0603]
R506  1K  [R0603]
U501  ME6206A33PG  [SOT-89-3_L4.5-W2.5-P1.50-LS4.2-BR]
U502  XC6206-2.8V  [SOT-23-3_L2.9-W1.6-P1.90-LS2.8-BR]
U503  XC6206-1.2V  [SOT-23-3_L2.9-W1.6-P1.90-LS2.8-BR]
X501  24MHz  [OSC-SMD_4P-L3.2-W2.5-BL]

## Library data of the parts
Bat_In SPK1 SPK2 = B2B-ZR(LF)(SN): LCSC Part Name: B2B-ZR (LF)(SN); Supplier Part: C158011; Manufacturer: JST; Supplier Footprint: 插件,P=1.5mm; JLCPCB Part Class: Extended Part; Datasheet: https://atta.szlcsc.com/upload/public/pdf/source/20181223/C158011_6CFD0C70F58E1854900B8AF425FE5444.pdf; Supplier: LCSC; Pitch: 1.5mm; Pins Structure: 1x2P; Number of Rows: 1; Number of PINs Per Row: 2; Contact Material: 黄铜
C001 C004 C401 C402 = CC0805ZKY5V7BB106: LCSC Part Name: 10uF -20%~+80% 16V; Supplier Part: C106836; Manufacturer: YAGEO(国巨); Supplier Footprint: 0805; JLCPCB Part Class: Extended Part; Datasheet: https://atta.szlcsc.com/upload/public/pdf/source/20170523/1495533897565.pdf; Supplier: LCSC; Temperature Coefficient: Y5V; Tolerance: -20%~+80%; Voltage Rated: 16V
C002 C003 C005 C007 C008 C009 C011 C101-C106 C201-C205 C301-C303 C501-C513 = CAP_0603: Supplier Footprint: 0603
C006 C010 = VEJ101M1CTR-0605: LCSC Part Name: 100uF ±20% 16V; Supplier Part: C164064; Manufacturer: lelon(立隆); Supplier Footprint: SMD,6.3x5.3mm; JLCPCB Part Class: Extended Part; Datasheet: https://atta.szlcsc.com/upload/public/pdf/source/20180126/C164064_15169515392981308320.pdf; Supplier: LCSC; Tolerance: ±20%; Rated Voltage: 16V; φD: 6.3mm; L: 5.3mm; Lifetime @ Temp: 2000hrs@105℃; Operating Temperature: -45℃~+105℃
D001 D002 D401 D403 = 1N4148WT: LCSC Part Name: 75V 300mA 4ns; Supplier Part: C232841; Manufacturer: onsemi(安森美); Supplier Footprint: SOD-523F; JLCPCB Part Class: Extended Part; Datasheet: https://atta.szlcsc.com/upload/public/pdf/source/20181222/C232841_42C5BA49E5A441BB8F6B91D0F4CD0D51.pdf; Supplier: LCSC; Diode Configuration: 独立式; Power Dissipation: 200mW; Reverse Voltage (Vr): 75V; Average Rectified Current (Io): 300mA; Forward Voltage (Vf@If): 1V@10mA; Reverse Leakage Current: 5μA@75V; Reverse Recovery Time (trr): 4ns; Operating Temperature: -55℃~+150℃@(Tj)
H001 H003 H101 H104 H401 = PZ254V-12-6P: LCSC Part Name: 2.54mm 2x3P 直插 方针; Supplier Part: C492420; Manufacturer: XFCN(兴飞); Supplier Footprint: 插件,P=2.54mm; JLCPCB Part Class: Extended Part; Datasheet: https://atta.szlcsc.com/upload/public/pdf/source/20200309/C492420_BAECB307B001054C09D200388220EAE6.pdf; Supplier: LCSC; Pitch: 2.54mm; Number of Pins: 6; Number of Rows: 2; Pin Structure: 2x3P; Row Spacing: 2.54mm; Mounting Type: 直插; Circluar Pins/Square Pins: 方针; Length of Mating Pin: 6mm; Insulation Height: 2.5mm; Length of End Connection Pin: 3mm; Contact Material: 黄铜; Operating Temperature Range: -40℃~+105℃; Color: 黑色
H002 H102 = Finger_2*5
H004 U205 = connector_p10_1.5mm
H005 = Metal_Detect
H502 H503 = conn-2*9p
J001 J002 J003 = 2.54-2*7P母: LCSC Part Name: 2.54mm 2x7P; Supplier Part: C38844; Manufacturer: BOOMELE(博穆精密); Supplier Footprint: 直插,P=2.54mm; JLCPCB Part Class: Extended Part; Datasheet: https://atta.szlcsc.com/upload/public/pdf/source/20151109/1457707558102.pdf; Supplier: LCSC; Pitch: 2.54mm; Number of Holes: 14; Number of Rows: 2; Holes Structure: 2x7P; Row Spacing: 2.54mm; Mounting Type: 直插; Contact Material: 黄铜
L001 = CKL0514-470uH/J-CCA T: LCSC Part Name: 470uH ±5% 280mA 3.22Ω; Supplier Part: C354673; Manufacturer: CENKER(岑科); Supplier Footprint: 轴向引线; JLCPCB Part Class: Extended Part; Datasheet: https://atta.szlcsc.com/upload/public/pdf/source/20190315/C354673_825EB25F3EB411343FC5F933A0BC0339.pdf; Supplier: LCSC; Type: 色环电感; Tolerance: ±5%; Rated Current: 280mA; DC Resistance: 3.22Ω
Q001 = SS8550: Supplier Part: C727138; Manufacturer: TWGMC(台湾迪嘉); Supplier Footprint: SOT-23; JLCPCB Part Class: Extended Part; Datasheet: https://atta.szlcsc.com/upload/public/pdf/source/20200827/C727138_BA615C6C75A6E3189106DA068B2571C1.pdf; Supplier: LCSC; Transistor Type: PNP; Collector-Emitter Breakdown Voltage (Vceo): 25V; Collector Current (Ic): 1.5A; Power Dissipation (Pd): 300mW; Collector-Emitter Saturation Voltage (VCE(sat)@Ic,Ib): 500mV@800mA,80mA; DC Current Gain (hFE@Ic,Vce): 200@100mA,1V; Transition Frequency (fT): 100MHz; Operating Temperature: +150℃@(Tj)
Q002 = AO4407C: LCSC Part Name: P沟道 30V 14A 产地：重庆; Supplier Part: C469397; Manufacturer: AOS; Supplier Footprint: SOP-8; JLCPCB Part Class: Extended Part; Datasheet: https://atta.szlcsc.com/upload/public/pdf/source/20191212/C469397_0FA240FA8DBDAEB8A8E95B002A232449.pdf; Supplier: LCSC; Type: P沟道; Drain Source Voltage (Vdss): 30V; Continuous Drain Current (Id): 14A; Power Dissipation (Pd): 3.1W; Drain Source On Resistance (RDS(on)@Vgs,Id): 11.5mΩ@10V,14A; Gate Threshold Voltage (Vgs(th)@Id): 2.3V@250μA
Q003 Q102-Q104 = SS8050: LCSC Part Name: SS8050 Y1 200-350 Y1 200-350; Supplier Part: C2150; Manufacturer: CJ（江苏长电/长晶）; Supplier Footprint: SOT-23(SOT-23-3); JLCPCB Part Class: Basic Part; Datasheet: https://atta.szlcsc.com/upload/public/pdf/source/20140809/1457707209319.pdf; Supplier: LCSC; Transistor Type: NPN; Collector-Emitter Breakdown Voltage (Vceo): 25V; Collector Current (Ic): 1.5A; Power Dissipation (Pd): 300mW; Collector-Emitter Saturation Voltage (VCE(sat)@Ic,Ib): 500mV@800mA,80mA; DC Current Gain (hFE@Ic,Vce): 200@100mA,1V; Transition Frequency (fT): 100MHz; Operating Temperature: +150℃@(Tj)
R001 R002 R003 R004 R005 R006 R101-R103 R201-R225 R301-R303 R401-R416 R501-R507 = Res_0603: Supplier Footprint: 0603
S001 S002 S003 S004 = TC-1102N-C-A-B: LCSC Part Name: 6*6*5.0带支架 侧边按键 力度260gf 高寿命; Supplier Part: C406152; Manufacturer: XKB Connectivity(中国星坤); Supplier Footprint: 插件; JLCPCB Part Class: Extended Part; Datasheet: https://atta.szlcsc.com/upload/public/pdf/source/20211011/8943A334D21548136505FDDC6F7285B9.pdf; Supplier: LCSC; Contact Current: 50mA; Voltage Rating (DC): 12V; Insulation Resistance: 100mΩ; Circuit: 单刀单掷; Mounting Style: 卧插; Actuator Style: 圆形按钮; Actuator/Cap Color: 黑色; With Lamp: 无; Operating Force: 260gf; Mechanical Life: 300000; Operating Temperature: -30℃~+85℃; Pin Style: PC引脚; Switch Length: 6mm; Switch Width: 6mm; Switch Height: 5mm; Strike Gundam: 是
U001 = ESP32-S3-WROOM-1U
U002 = GPBA02B-C
U003 U204 U501 = ME6209A33PG: LCSC Part Name: Vin=18V Vout=3.3V 250mA; Supplier Part: C80222; Manufacturer: MICRONE(南京微盟); Supplier Footprint: SOT-89(SOT-89-3); JLCPCB Part Class: Extended Part; Datasheet: https://atta.szlcsc.com/upload/public/pdf/source/20160903/1472896599532.pdf; Supplier: LCSC; Output Type: 固定; Output Polarity: 正; Number of Outputs: 1; Maximum Input Voltage: 18V; Output Voltage: 3.3V; Dropout Voltage: 80mV@(40mA); Output Current: 250mA
U004 = CX8823_5V
H103 = MTP125-1205S1: LCSC Part Name: 2.54mm 2x5P 直插 方针; Supplier Part: C358694; Manufacturer: MINTRON(明硕); Supplier Footprint: 直插,P=2.54mm; JLCPCB Part Class: Extended Part; Datasheet: https://atta.szlcsc.com/upload/public/pdf/source/20190124/C358694_E064CA5513580D5D1E2D2AA5B37BD31F.pdf; Supplier: LCSC; Pitch: 2.54mm; Number of Pins: 10; Number of Rows: 2; Pin Structure: 2x5P; Row Spacing: 2.54mm; Mounting Type: 直插; Circluar Pins/Square Pins: 方针; Length of Mating Pin: 6mm; Insulation Height: 2.5mm; Length of End Connection Pin: 3mm; Contact Material: 黄铜; Operating Temperature Range: -40℃~+105℃; Color: 黑色
Q101 = AO3407: LCSC Part Name: P沟道 30V 4.1A; Supplier Part: C427386; Manufacturer: MDD; Supplier Footprint: SOT-23; JLCPCB Part Class: Extended Part; Datasheet: https://atta.szlcsc.com/upload/public/pdf/source/20200323/C427386_85D7E7823FFE65CD958D58FA92E0A192.pdf; Supplier: LCSC; Type: P沟道; Drain Source Voltage (Vdss): 30V; Continuous Drain Current (Id): 4.1A; Power Dissipation (Pd): 1.2W; Drain Source On Resistance (RDS(on)@Vgs,Id): 43mΩ@10V,4A; Gate Threshold Voltage (Vgs(th)@Id): 1.6V@250uA; Total Gate Charge (Qg@Vgs): 8.2nC@10V; Input Capacitance (Ciss@Vds): 493pF@15V; Reverse Transfer Capacitance (Crss@Vds): 44pF@15V; Operating Temperature: +150℃@(Tj)
R104-R109 = 0805W8F1002T5E_C17414: Supplier: LCSC; Manufacturer: UNI-ROYAL(厚声); Manufacturer Part: 0805W8F1002T5E; JLCPCB Part Class: Basic Part; LCSC Part Name: 10kΩ ±1% 125mW 厚膜电阻; Supplier Footprint: 0805; Datasheet: https://atta.szlcsc.com/upload/public/pdf/source/20200306/C422600_1E6D84923E4A46A82E41ADD87F860B5C.pdf; Type: 厚膜电阻; Tolerance: ±1%; Power(Watts): 125mW; Overload Voltage (Max): 150V; Temperature Coefficient: ±100ppm/℃; Operating Temperature Range: -55℃~+155℃
U101 = SD18OB261-104
U102 U103 = HT517
D201 = SS14_C84343: LCSC Part Name: 40V 1A 550mV@1A; Supplier Part: C84343; Manufacturer: 星海; Supplier Footprint: SMA(DO-214AC); JLCPCB Part Class: Extended Part; Datasheet: https://atta.szlcsc.com/upload/public/pdf/source/20161024/1477288629719.pdf; Supplier: LCSC; Reverse Voltage (Vr): 40V; Average Rectified Current (Io): 1A; Forward Voltage (Vf@If): 550mV@1A
L201 = YNR4030-220M: LCSC Part Name: 22uH ±20% 1A 225mΩ; Supplier Part: C341013; Manufacturer: YJYCOIN(益嘉源); Supplier Footprint: SMD,4x4x3mm; JLCPCB Part Class: Extended Part; Datasheet: https://atta.szlcsc.com/upload/public/pdf/source/20200623/C340386_9AA10DB3E9692149FF2BB278AFBCE083.pdf; Supplier: LCSC; Tolerance: ±20%; Rated Current: 1A; DC Resistance (DCR): 225mΩ
U201 = TF-01A_C91145: Supplier Part: C91145; Manufacturer: 韩国韩荣; Supplier Footprint: SMD; JLCPCB Part Class: 扩展库; Datasheet: https://atta.szlcsc.com/upload/public/pdf/source/20190322/C91145_63CBD6FB4639A3A3EC6A9721F18AE0FB.pdf; Supplier: LCSC; Connector Type: 卡座; Card Type: MicroSD卡(TF卡); Card Connection Mode: 自弹式
U202 = LCD_GD040HV157B
U203 = MT9201
D206 = LED_0603-R: Supplier Footprint: 0603
D301 = SS34A_C211775: LCSC Part Name: 40V 3A 500mV@3A; Supplier Part: C211775; Manufacturer: YANGJIE(扬杰); Supplier Footprint: SMA; JLCPCB Part Class: Extended Part; Datasheet: https://atta.szlcsc.com/upload/public/pdf/source/20190516/C211775_5CF5F6A2E43CD0CA4A389CCA8A88582C.pdf; Supplier: LCSC; Reverse Voltage (Vr): 40V; Average Rectified Current (Io): 3A; Forward Voltage (Vf@If): 500mV@3A
H301 = typec-31-e-11
H302-H305 = Single_Pin
L301 = SCCD54-4R7MT: LCSC Part Name: 4.7uH ±20% 2.5A 38mΩ; Supplier Part: C532870; Manufacturer: Yanchuang(研创); Supplier Footprint: SMD; JLCPCB Part Class: Extended Part; Datasheet: https://atta.szlcsc.com/upload/public/pdf/source/20200515/C532850_02BFFFF91E0F9B1D12EE1A1A1220C654.pdf; Supplier: LCSC; Tolerance: ±20%; Rated Current: 2.5A; DC Resistance (DCR): 38mΩ
U301 = CS5095E
Q401 Q405 = MMBT3904: Supplier Part: C84104; Manufacturer: ST(先科); Supplier Footprint: SOT-23(SOT-23-3); JLCPCB Part Class: Extended Part; Datasheet: https://atta.szlcsc.com/upload/public/pdf/source/20161024/1477288599731.pdf; Supplier: LCSC; Transistor Type: NPN; Collector-Emitter Breakdown Voltage (Vceo): 40V; Collector Current (Ic): 200mA; Power Dissipation (Pd): 350mW; Collector Cut-Off Current (Icbo): 50nA; Collector-Emitter Saturation Voltage (VCE(sat)@Ic,Ib): 300mV@50mA,5mA; DC Current Gain (hFE@Ic,Vce): 100@10mA,1V; Transition Frequency (fT): 300MHz; Operating Temperature: +150℃@(Tj)
Q402 = MMBT3906-7-F: Supplier Part: C82762; Manufacturer: DIODES(美台); Supplier Footprint: SOT-23(SOT-23-3); JLCPCB Part Class: Extended Part; Datasheet: https://atta.szlcsc.com/upload/public/pdf/source/20171221/C82762_15138313065711195601.pdf; Supplier: LCSC; Transistor Type: PNP; Collector-Emitter Breakdown Voltage (Vceo): 40V; Collector Current (Ic): 200mA; Power Dissipation (Pd): 300mW; Collector-Emitter Saturation Voltage (VCE(sat)@Ic,Ib): 400mV@50mA,5mA; DC Current Gain (hFE@Ic,Vce): 100@10mA,1V; Transition Frequency (fT): 250MHz; Operating Temperature: -55℃~+150℃@(Tj)
Q403 = AO3402A: Supplier Part: C347477; Manufacturer: UMW(友台半导体); Supplier Footprint: SOT-23; JLCPCB Part Class: Extended Part; Datasheet: https://atta.szlcsc.com/upload/public/pdf/source/20190109/C347477_203244A660E0B7D1849BF8F36C695C58.pdf; Supplier: LCSC
Q404 = AO3401A_C347476: Supplier Part: C347476; Manufacturer: UMW(友台半导体); Supplier Footprint: SOT-23; JLCPCB Part Class: Extended Part; Datasheet: https://atta.szlcsc.com/upload/public/pdf/source/20190827/C347476_6CCC01FEC3E3D166C83BA0E415FD2056.pdf; Supplier: LCSC
U401 = LM321-TR_C97688: Supplier Part: C97688; Manufacturer: 3PEAK; Supplier Footprint: SOT-23-5; JLCPCB Part Class: Extended Part; Datasheet: https://atta.szlcsc.com/upload/public/pdf/source/20170322/1490151696478.pdf; Supplier: LCSC; Amplifier Type: General Purpose; Number of Circuits: 1; Gain Bandwidth Product（GBP）: 1.2MHz; Slew Rate（SR）: 0.55 V/us; Supply Voltage（Single）: 3V ~ 36V, ±1.5V ~ 18V; Iq per channel (Typ): 200μA
H501 = AFC01-S24FCA-00: LCSC Part Name: 0.5mm P数:24P 翻盖式 下接; Supplier Part: C262669; Manufacturer: JS(钜硕电子); Supplier Footprint: SMD,P=0.5mm; JLCPCB Part Class: 扩展库; Datasheet: https://atta.szlcsc.com/upload/public/pdf/source/20190816/C413942_2A72D1AC756EAE17EEDF756A339D4500.pdf; Supplier: LCSC; Pitch: 0.5mm; Number of Contacts: 24P; Locking Feature: 翻盖式; Mounting Type: 卧贴; Contact Type: 下接; Height Above Board: 2mm; FFC, FCB Thickness: 0.3mm
L501 L502 = 暖白3528LED灯珠: LCSC Part Name: 暖白 3528 LED灯珠; Supplier Part: C26545; Supplier Footprint: 3528; JLCPCB Part Class: Extended Part; Supplier: LCSC
Q501 = AO3404A: LCSC Part Name: N沟道 30V 5.8A; Supplier Part: C30010; Manufacturer: AOS; Supplier Footprint: SOT-23-3L; JLCPCB Part Class: Extended Part; Datasheet: https://atta.szlcsc.com/upload/public/pdf/source/20191220/C30010_DF67985E36B4CD05195D0D938BA71633.pdf; Supplier: LCSC; Type: N沟道; Drain Source Voltage (Vdss): 30V; Continuous Drain Current (Id): 5.8A; Power Dissipation (Pd): 1.4W; Drain Source On Resistance (RDS(on)@Vgs,Id): 28mΩ@10V,5.8A; Gate Threshold Voltage (Vgs(th)@Id): 3V@250μA
U502 U503 = XC6206-2.8V: Supplier Part: C2892669; Manufacturer: YONGYUTAI(永裕泰); Supplier Footprint: SOT-23-3L; JLCPCB Part Class: 扩展库; Datasheet: https://atta.szlcsc.com/upload/public/pdf/source/20210901/DE3C77F0CE73FFE8F7C655BE9B94CB06.pdf; Supplier: LCSC; Output Type: 固定; Output Polarity: 正; Number of Outputs: 1; Maximum Input Voltage: 6V; Output Voltage: 2.8V; Output Current: 250mA; Operating Temperature: -40℃~+85℃@(Tj)
X501 = OT2EL4C4JI-111OLP-24M: LCSC Part Name: 24MHZ 1.8V-3.3V ±10PPM YSO110TR; Supplier Part: C5203548; Manufacturer: YXC(扬兴晶振); Supplier Footprint: SMD3225-4P; JLCPCB Part Class: 扩展库; Datasheet: https://atta.szlcsc.com/upload/public/pdf/source/20231227/5563D7688935AB8F439681C72F60F823.pdf; Supplier: LCSC; Normal temperature Frequency Tolerance: ±10ppm; Output Type: CMOS; Supply Voltage: 1.8V~3.3V; Operating Temperature: -40℃~+85℃

## Nets
+5V: C006.1 H002.10 H003.1 H004.1 H005.1(VCC) H503.1 L001.1 Q001.2(E) R002.1 U004.2(+5V)
+12V: C010.1 C011.2 Q002.5(D) Q002.6(D) Q002.7(D) Q002.8(D) U004.1(IN)
GND: Bat_In.2 C001.2 C002.2 C003.1 C004.1 C005.1 C006.2 C007.1 C008.1 C009.1 C010.2 C011.1 H001.6 H002.9 H003.6 H004.10 H005.6(GND) H503.18 J001.13 J001.14 J002.14 J003.13 J003.14 Q003.2(E) S001.1 S001.3 S001.4 S003.1 S003.3 S003.4 S004.1 S004.3 S004.4 U001.1(GND) U001.40(GND) U001.41(GND) U002.11(GND) U003.1(VSS) U004.3(GND) U004.4(GND)
VCC: C001.1 C002.1 C004.2 C005.2 C008.2 C009.2 H001.2 J001.1 J002.1 J003.1 Q001.3(C) R001.2 R005.2 R006.2 R507.2 U001.2(3V3) U002.17(VCC) U002.35(VDD) U003.3(VOUT)
BTN_DN: S004.2 U002.3(PA1/PWM1/INT1)
BTN_UP: S003.2 U002.2(PA0/PWM0/INT0)
CAM_1V2: C509.1 C510.1 H501.10 U503.2(VOUT)
CAM_2V8: C506.1 C507.1 H501.4 U502.2(VOUT)
CAM_3V3: C503.2 C504.2 C505.2 C508.2 C511.2 C512.1 H501.11 R501.2 U501.3(VOUT) U502.3(VIN) U503.3(VIN) X501.4(VDD)
CAM_5V0: C501.2 C502.2 H502.1 L501.1(A) L502.1(A) U501.2(VIN)
CAM_D0: H501.19 H502.13
CAM_D1: H501.21 H502.15
CAM_D2: H501.22 H502.16
CAM_D3: H501.20 H502.14
CAM_D4: H501.18 H502.12
CAM_D5: H501.16 H502.11
CAM_D6: H501.14 H502.10
CAM_D7: H501.12 H502.9
CAM_GND: C501.1 C502.1 C503.1 C504.1 C505.1 C506.2 C507.2 C508.1 C509.2 C510.2 C511.1 C512.2 C513.1 H501.2 H501.15 H501.25 H501.26 H502.18 Q501.2(S) R504.1 U501.1(VSS) U502.1(VSS) U503.1(VSS) X501.2(GND)
CAM_HREF: H501.9 H502.7
CAM_PCLK: H501.17 H502.8
CAM_PWDN: H501.8 H502.5
CAM_RESET: H501.6 H502.3
CAM_SIOC: H501.5 H502.4
CAM_SIOD: H501.3 H502.2
CAM_VSYNC: H501.7 H502.6
CAM_XCLK: H501.13 R506.1
CMA_LIGHT: H502.17 R505.2
DEBUG_3V3: H103.3 H103.4 H103.6
DEBUG_5V0: H103.1 H103.2 H104.1
DEBUG_BOOT: H104.2 Q103.3(C)
DEBUG_DTR: H103.10 Q103.2(E) R109.1
DEBUG_GND: H103.5 H104.6
DEBUG_RESEST: H104.4 Q104.3(C)
DEBUG_RTS: H103.8 Q104.2(E) R108.1
DEBUG_RXD: H103.7 H104.3
DEBUG_TXD: H103.9 H104.5
ESP_BOOT: H003.2 J003.12 R507.1 U001.27(IO0)
ESP_IO1: H005.4(ADC_Out) J003.2 U001.39(IO1)
ESP_IO2: H005.5(Signal_In) J003.3 U001.38(IO2)
ESP_IO3: H503.15 J002.2 U001.15(IO3)
ESP_IO4: J001.2 U001.4(IO4)
ESP_IO5: H503.2 J001.3 R006.1 U001.5(IO5)
ESP_IO6: H503.4 J001.4 R005.1 U001.6(IO6)
ESP_IO7: H503.7 J001.5 U001.7(IO7)
ESP_IO8: H503.13 J001.10 U001.12(IO8)
ESP_IO9: H503.6 J002.4 U001.17(IO9)
ESP_IO10: H503.8 J002.5 U001.18(IO10)
ESP_IO11: H004.9 J002.6 U001.19(IO11)
ESP_IO12: H004.8 J002.7 U001.20(IO12)
ESP_IO13: H004.7 J002.8 U001.21(IO13)
ESP_IO14: H004.6 J002.9 U001.22(IO14)
ESP_IO15: H503.9 J001.6 U001.8(IO15)
ESP_IO16: H503.10 J001.7 U001.9(IO16)
ESP_IO17: H503.11 J001.8 U001.10(IO17)
ESP_IO18: H503.12 J001.9 U001.11(IO18)
ESP_IO19: H503.14 J001.11 U001.13(IO19)
ESP_IO20: H503.16 J001.12 U001.14(IO20)
ESP_IO21: H004.5 J002.10 U001.23(IO21)
ESP_IO35: H004.3 J003.11 U001.28(IO35)
ESP_IO36: H004.4 J003.10 U001.29(IO36)
ESP_IO37: H004.2 J003.9 U001.30(IO37)
ESP_IO38: H002.5 J003.8 U001.31(IO38)
ESP_IO39: H002.3 J003.7 U001.32(IO39)
ESP_IO40: H002.1 J003.6 U001.33(IO40)
ESP_IO41: H001.3 J003.5 U001.34(IO41)
ESP_IO42: H001.1 J003.4 U001.35(IO42)
ESP_IO45: J002.13 U001.26(IO45) U002.31(SCK)
ESP_IO46: J002.3 U001.16(IO46) U002.33(CSB)
ESP_IO47: J002.11 U001.24(IO47) U002.32(MISO)
ESP_IO48: J002.12 U001.25(IO48) U002.30(MOSI)
ESP_RESET: C003.2 H003.4 R001.1 S001.2 U001.3(EN)
ESP_RXD: H003.5 U001.36(RXD0)
ESP_TXD: H003.3 U001.37(TXD0)
HT517_BLCK: H102.1 U102.16(DAI0) U103.14(DAI1)
HT517_CN1_N: H102.4 U102.10(OUTN)
HT517_CN1_P: H102.2 U102.9(OUTP)
HT517_CN2_N: H102.8 U103.10(OUTN)
HT517_CN2_P: H102.6 U103.9(OUTP)
HT517_DIN: H102.5 U102.1(DAI2) U103.16(DAI0)
HT517_EN: H102.7 U102.4(EN) U103.4(EN)
HT517_GND: C103.1 C104.1 C105.1 C106.1 H102.9 R104.2 R106.2 U102.3(GND0) U102.11(GND1) U102.15(GND2) U102.17(EP) U103.3(GND0) U103.11(GND1) U103.15(GND2) U103.17(EP)
HT517_LRCK: H102.3 U102.14(DAI1) U103.1(DAI2)
HT517_VCC: C103.2 C104.2 C105.2 C106.2 H102.10 R105.2 R107.2 U102.7(VDD) U102.8(VDD1) U103.7(VDD) U103.8(VDD1)
I2S_EN: H002.7 U002.12(PB1/CMOS1_OUT)
METAL_ENABLE: H005.3(Enable) U002.13(PB2/CMOS2_IN)
MIC_CLK: H101.3 U101.4(CLK)
MIC_DAT: H101.1 U101.1(DAT)
MIC_EN: H101.5 R103.2
MIC_GND: C101.1 C102.1 H101.6 Q102.2(E) U101.3(GND)
MIC_VCC: H101.2 Q101.2(S) R101.2
P0_CAM_PWDN: H503.5 U002.5(PA3/PWM3/INT3)
P0_CAM_RESET: H503.3 U002.4(PA2/PWM2/INT2)
P0_CMA_LIGHT: H503.17 U002.6(PA4/PWM4/INTF)
P2_5.0V: C203.2 C204.2 L201.1 U203.6(VIN) U204.2(VIN) U205.1
P2_CLK: R203.1 U201.5(CLK(SCLK)) U202.10(WR/SCL) U205.4
P2_GND: C201.1 C202.1 C203.1 C204.1 C205.1 R205.1 R206.2 R207.2 R208.2 R209.2 R210.2 R211.2 R212.2 R213.2 R214.2 R217.2 R219.2 U201.6(VSS) U201.10(GND) U201.11(GND) U201.12(GND) U201.13(GND) U202.3(GND) U202.6(GND) U202.12(GND) U202.18(GND) U202.28(GND) U203.2(GND) U204.1(VSS) U205.10
P2_LCD_ANODE: C202.2 D201.1(K) U202.2(LED+) U203.5(OV)
P2_LCD_CATHODE: R205.2 U202.1(LED-) U203.3(FB)
P2_LCD_CS: U202.8(CS) U205.6
P2_LCD_DB0: R206.1 U202.19(DB0)
P2_LCD_DB1: R207.1 U202.20(DB1)
P2_LCD_DB2: R208.1 U202.21(DB2)
P2_LCD_DB3: R209.1 U202.22(DB3)
P2_LCD_DB4: R210.1 U202.23(DB4)
P2_LCD_DB5: R211.1 U202.24(DB5)
P2_LCD_DB6: R212.1 U202.25(DB6)
P2_LCD_DB7: R213.1 U202.26(DB7)
P2_LCD_DB8: R214.1 U202.27(DB8)
P2_LCD_IM0: R215.1 R218.1 R221.1 U202.13(IM0)
P2_LCD_IM1: R216.1 R219.1 R222.1 U202.14(IM1)
P2_LCD_IM2: R217.1 R220.1 R223.1 U202.15(IM2)
P2_LCD_RD: U202.11(RD) U205.9
P2_LCD_RESET: U202.7(RESET) U205.8
P2_LCD_RS: U202.9(RS) U205.7
P2_MISO: R201.1 R224.2 U201.7(DAT0(D0)) U205.2
P2_MOSI: R202.1 U201.3(CMD(DI)) U202.17(SDA) U205.3
P2_SD_CS: R204.1 U201.2(CDDAT3(CS)) U205.5
P2_VCC: C201.2 C205.2 R201.2 R202.2 R203.2 R204.2 R215.2 R216.2 R218.2 R220.2 R221.2 R222.2 R223.2 R225.1 U201.4(VDD) U202.4(VDD) U202.5(IOVCC) U204.3(VOUT)
P4_GND: H401.6 Q401.2(E) Q403.2(S) Q405.2(E) R405.1 R409.2 R414.1 U401.2(V-)
P4_L_CATHODE: H401.2 Q403.3(D) R406.1 R407.2
P4_METAL_ADC: H401.4 R413.1 R414.2
P4_METAL_EN: H401.3 R412.1
P4_METAL_PULSE: H401.5 R401.1
P4_VCC: H401.1 Q404.2(S) R411.1
PDM_EN: H001.5 U002.10(PB0/CMOS1_IN)
POWER_LOCK: D001.2(A) U002.14(PB3/CMOS2_OUT)
SPK1_N: H002.4 SPK1.2
SPK1_P: H002.2 SPK1.1
SPK2_N: H002.8 SPK2.2
SPK2_P: H002.6 SPK2.1
USB+: C301.1 H301.2(VBUS) H301.5(VBUS) L301.2 R301.2 U301.1(VIN)
USB-: C301.2 C302.2 C303.2 H301.1(GND) H301.6(GND) H301.7(SHELL) H301.8(SHELL) H304.1 H305.1 R302.1 R303.1 R415.1 R416.1 U301.2(AGND) U301.9(ThermalPad)
VBIN: C303.1 H302.1 H303.1 U301.5(BAT)
$1N5617: C007.2 Q001.1(B) R002.2 U003.2(VIN)
$1N9021: H005.2(Inductor) L001.2
$1N9369: Q002.4(G) Q003.3(C) R003.1
$1N9446: Q003.1(B) R004.1
$1N9664: D002.2(A) S002.1
$1N9668: D001.1(C) D002.1(C) R004.2
$1N9696: Bat_In.1 Q002.1(S) Q002.2(S) Q002.3(S) R003.2 S002.2
$2N358: C101.2 C102.2 Q101.3(D) U101.2(L/R) U101.5(VDD)
$2N709: Q101.1(G) R101.1 R102.2
$2N810: Q102.3(C) R102.1
$2N897: Q102.1(B) R103.1
$2N2003: R104.1 R105.1 U102.2(GAIN/CH)
$2N2005: R106.1 R107.1 U103.2(GAIN/CH)
$2N3190: Q103.1(B) R108.2
$2N3194: Q104.1(B) R109.2
$3N1120: D201.2(A) L201.2 U203.1(SW)
$3N1978: R224.1 U202.16(SDO)
$3N2623: R225.2 U203.4(EN)
$4N871: Q401.1(B) R401.2
$4N873: Q401.3(C) R402.1 R403.1
$4N875: Q402.1(B) R403.2
$4N877: Q402.3(C) R404.2
$4N879: Q403.1(G) R404.1 R405.2
$4N893: C401.2 D401.1(C) D403.2(A) R407.1
$4N898: C402.1 R408.2 R409.1 U401.1(+IN)
$4N903: R410.1 R413.2 U401.4(OUT)
$4N908: C402.2 D401.2(A) D403.1(C) Q402.2(E) Q404.3(D) R402.2 R406.2 R408.1 U401.5(V+)
$4N926: C401.1 R410.2 U401.3(-IN)
$4N1398: Q404.1(G) Q405.3(C) R411.2
$4N1499: Q405.1(B) R412.2
$5N399: C302.1 D301.1(C) U301.4(VBS)
$5N401: D301.2(A) L301.1 U301.3(LX)
$5N413: D206.2(A) R301.1
$5N415: D206.1(C) U301.8(STAT)
$5N418: R302.2 U301.7(NTC)
$5N420: R303.2 U301.6(ICHG)
$5N663: H301.3(CC1) R415.2
$5N667: H301.4(CC2) R416.2
$6N1076: R501.1 X501.1(Tri-state)
$6N1779: L501.2(K) R502.2
$6N1805: L502.2(K) R503.2
$6N1887: Q501.3(D) R502.1 R503.1
$6N1935: Q501.1(G) R504.2 R505.1
$6N2239: C513.2 R506.2 X501.3(OUT)

Not connected (* = marked no-connect by the designer): H001 4; H101 4; H501 1* 23* 24*; S002 3 4; U002 7(PA5/PWM5) 8(PA6/PWM6) 9(PA7/PWM7) 15(PB4/CMOS3_IN) 20(PC0/PWM8) 21(PC1/PWM9) 22(PC2/PWM10) 23(PC3/PWM11) 24(PC4/PWM12) 25(PC5/PWM13) 26(PC6/PWM14) 27(PC7/PWM15); U102 5(NC1) 6(NC2) 12(NC3) 13(NC4); U103 5(NC1) 6(NC2) 12(NC3) 13(NC4); U201 1(DAT2(RSV)) 8(DAT1(RSV)) 9(CD)*

## Notes on the sheets
sheet 1
- RESET
- DEBUG
- MEMS MICPHONE
- Sound Amplifier
- IO - Seat
- Button
- POWER-LOCK
- camera
- LCD&SD
- Metal_detect
- 12V -> 5V -> 3.3V
sheet 2
- mems mic
- UART-DEBUG
- Amplifier
sheet 3
- 8080-8BIT
- SD CARD
- SPI-3Wire
- SPI-4Wire
sheet 4
- Inductor feature:
  1. diameter : 20~30 cm
  2. number of turns: 25 ~ 30 rounds
  3. wire :  multi-strand Lite wires 0.1 * 60
- 6.83V
sheet 6
- FPC 0.5mm 24Pin 下接
- Top-Left
- AVDD
- DVDD
- DOVDD
- Top-Right

# Board PCB1
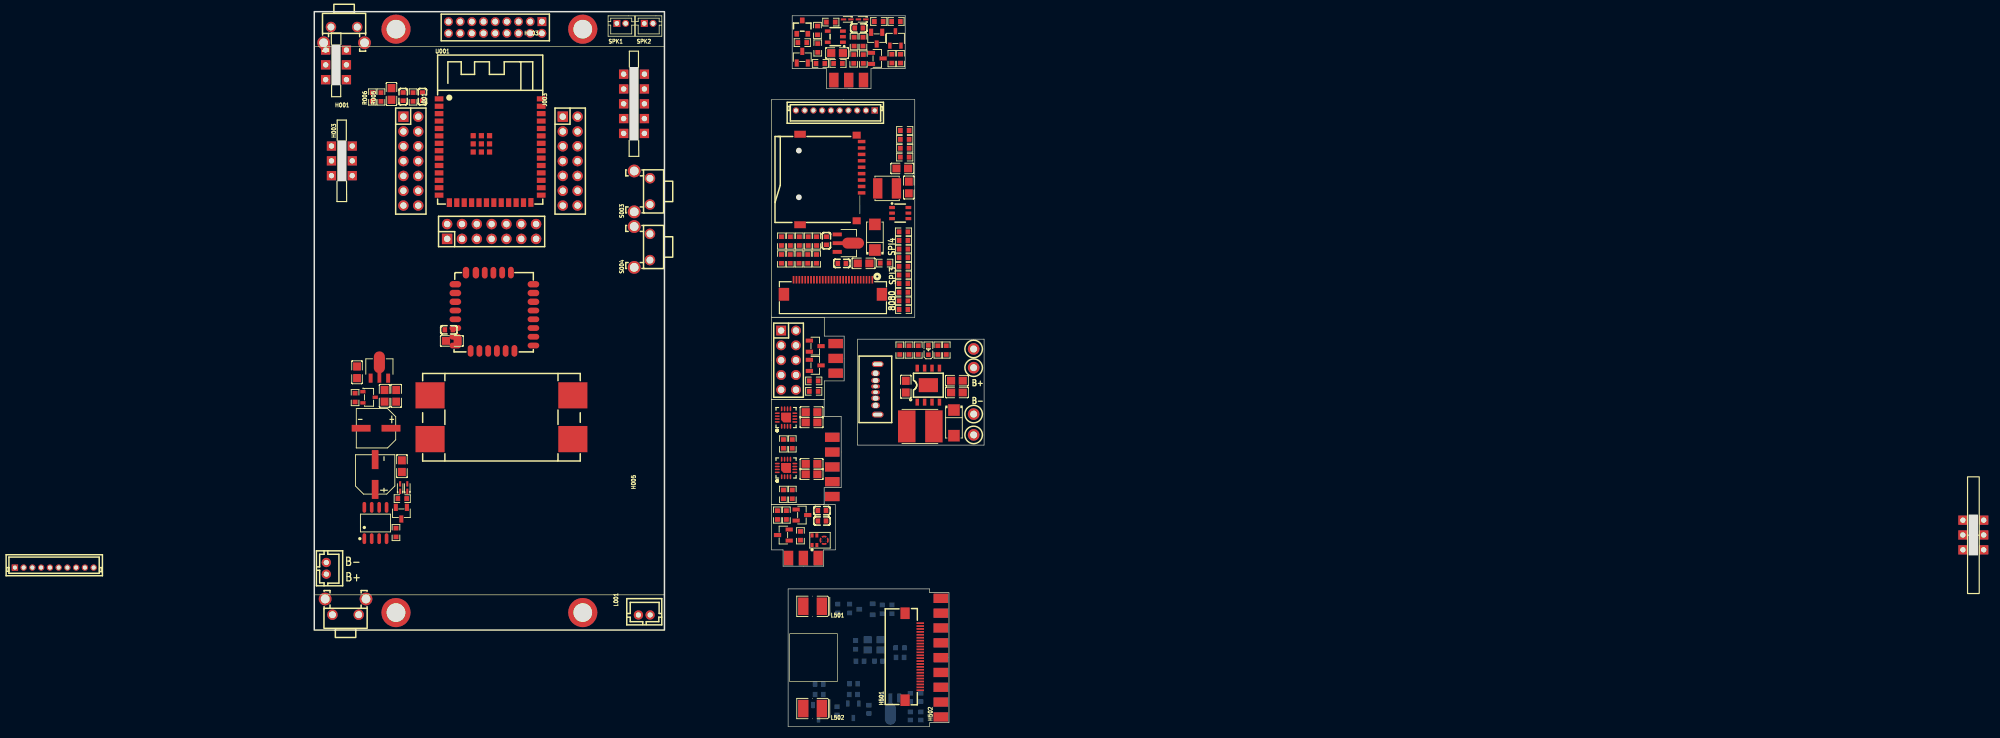
[diagram p6: board, top side]
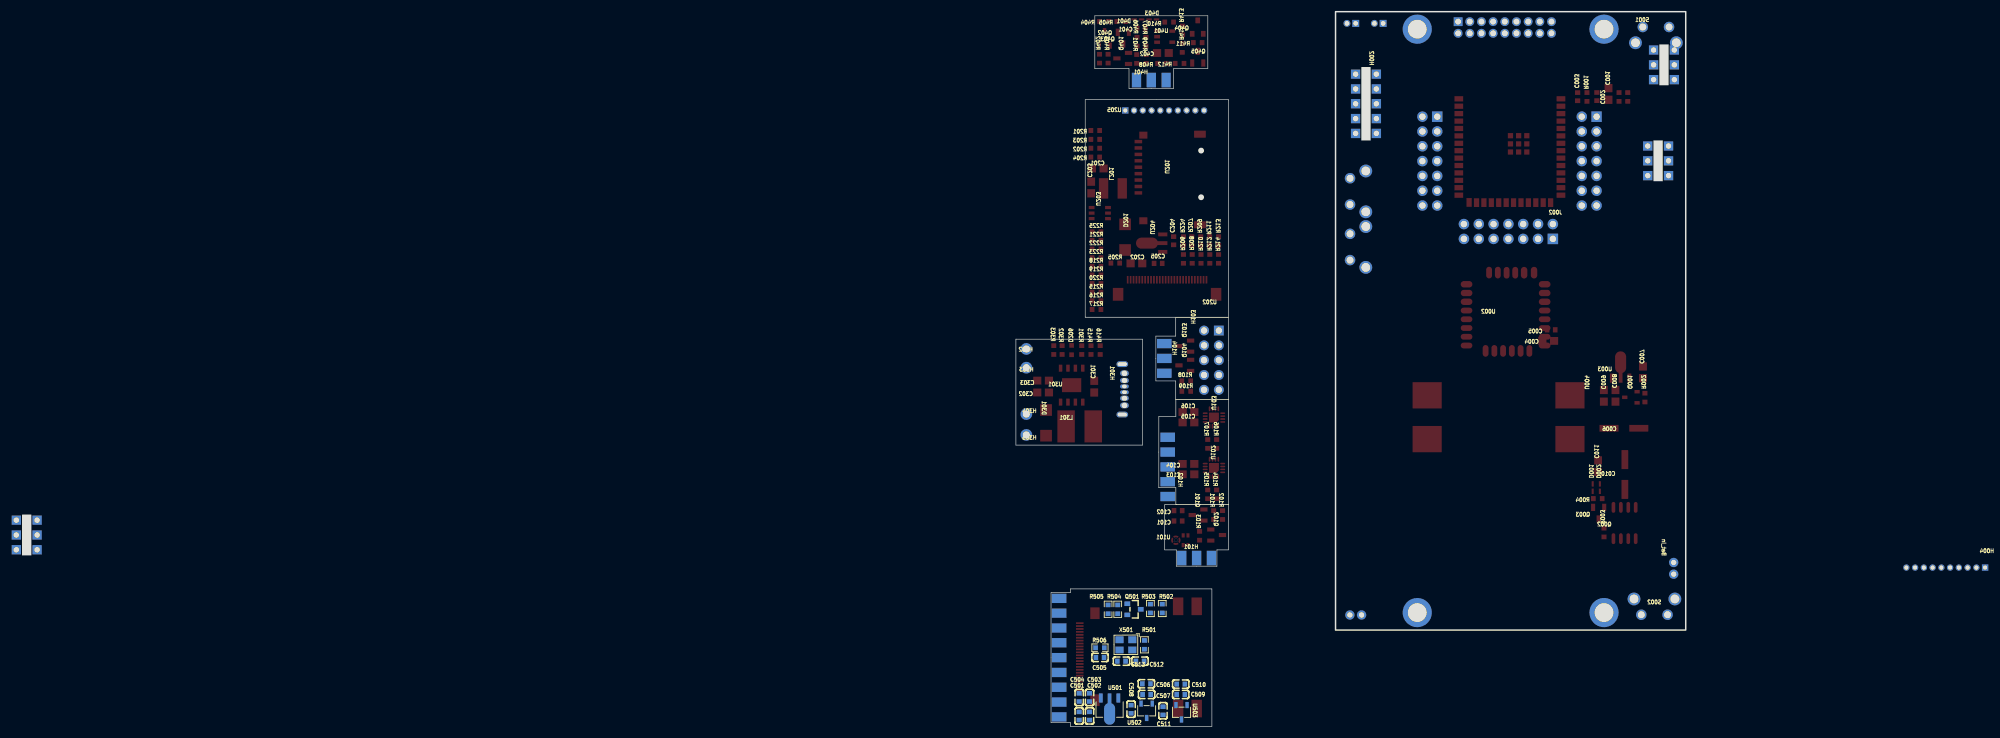
[diagram p7: board, bottom side, seen from below]

Outline 285.05 x 122.5 mm; copper layers: Top Layer, Bottom Layer. Coordinates in mm from the lower left corner of the outline.
Outline path: rectangle 0,122.5 60,16.5 ; 78.34,37.99 78.34,56.03 87.36,56.03 87.36,53.11 90.28,53.11 90.28,40.91 87.36,40.91 87.36,37.99 78.34,37.99 ; 78.34,37.99 78.34,30.25 80.32,30.25 80.32,27.45 87.29,27.45 87.29,30.25 89.27,30.25 89.27,37.99 78.34,37.99 ; 91.58,109.35 87.74,109.35 87.74,112.75 81.88,112.75 81.88,121.79 101.25,121.79 101.25,112.75 95.39,112.75 95.39,109.34 91.55,109.34 ; 78.34,70.07 87.38,70.07 87.38,66.89 90.79,66.89 90.79,59.21 87.38,59.21 87.38,56.03 78.34,56.03 78.34,70.07 ; 78.36,107.41 102.89,107.41 102.89,70.12 78.36,70.12 78.36,107.35 78.36,107.41 ; 81.19,0 81.19,23.55 105.45,23.55 105.45,22.92 108.75,22.92 108.75,0.63 105.45,0.63 105.45,0 81.19,0 ; 93.09,66.37 93.09,48.21 114.77,48.21 114.77,66.37 93.09,66.37
Stack: Top Layer 0.035mm / Dielectric1 1.51mm FR4 er 4.5 / Bottom Layer 0.035mm

## Design rules (mm)
template: JLCPCB Capability(Two Layers Board)
spacing copperThickness1oz (default): track to track 0.102, other pairs 0.152 to 0.3
spacing copperThickness2oz: track to track 0.203, other pairs 0.152 to 0.3
track width copperThickness1oz (default): min 0.127, default 0.254, max 2.54
track width copperThickness2oz: min 0.203, default 0.254, max 2.54
differential pair differentialPair (default): width min 0.127, default 0.254, max 2.54; gap min 0.152, default 0.152
via viaSize (default): diameter min 0.5, default 0.61, max 10; hole min 0.3, default 0.305, max 6.3

## Placement (name value [footprint] x y rotation side)
Bat_In  B2B-ZR(LF)(SN)  [connector_p2_2.0mm]  2.06 27.08 270 top
C001  10uF  [C0805]  13.23 108.4 90 top
C002  100nF  [C0603]  15.22 107.95 90 top
C003  100nF  [C0603]  18.52 107.93 270 top
C004  10uF  [C0805]  23.57 66.06 0 top
C005  100nF  [C0603]  23.06 67.97 0 top
C006  100uF  [CAP-SMD_BD6.3-L6.6-W6.6-LS7.2-R-RD]  10.59 51.1 0 top
C007  100nF  [C0805]  7.33 60.68 90 top
C008  10uF  [C0805]  12.04 56.66 90 top
C009  100nF  [C0805]  14.03 56.66 90 top
C010  100uF  [CAP-SMD_BD6.3-L6.6-W6.6-LS7.2-R-RD]  10.43 43.16 270 top
C011  100nF  [C0805]  15.02 44.59 270 top
C101  100nF  [C0603]  86.98 35.2 180 top
C102  100nF  [C0603]  86.98 36.98 180 top
C103  100nF  [C0805]  85.2 43.2 180 top
C104  100nF  [C0805]  85.2 44.98 180 top
C105  100nF  [C0805]  85.2 52.09 180 top
C106  100nF  [C0805]  85.2 53.87 180 top
C201  100nF  [C0805]  100.75 95.62 180 top
C202  100nF  [C0805]  94.12 79.36 0 top
C203  100nF  [C0805]  101.87 92.36 270 top
C204  100nF  [C0603]  87.74 83.24 270 top
C205  100nF  [C0603]  90.4 79.36 180 top
C301  10uF  [C0805]  101.34 58.22 90 top
C302  22uF  [C0805]  110.11 57.22 0 top
C303  100uF  [C0805]  110.11 59.26 0 top
C401  1uF  [C0603]  93.3 119.7 0 top
C402  1uF  [C0805]  89.58 115.41 180 top
C501  100nF  [C0603]  103.93 1.78 270 bottom
C502  10uF  [C0603]  102.14 1.78 270 bottom
C503  10uF  [C0603]  102.14 4.95 90 bottom
C504  100nF  [C0603]  103.92 4.95 90 bottom
C505  0.1UF  [C0603]  100.36 11.81 0 bottom
C506  10UF  [C0603]  92.41 7.3 180 bottom
C507  0.1UF  [C0603]  92.36 5.46 180 bottom
C508  0.1UF  [C0603]  95.03 2.92 270 bottom
C509  10UF  [C0603]  86.52 5.46 180 bottom
C510  0.1UF  [C0603]  86.52 7.24 180 bottom
C511  0.1UF  [C0603]  89.57 2.67 270 bottom
C512  100nF  [C0603]  93.51 11.18 0 bottom
C513  20pF  [C0603]  96.68 11.18 0 bottom
D001  1N4148WT  [SOD-523_L1.2-W0.8-LS1.6-RD]  15.94 40.92 90 top
D002  1N4148WT  [SOD-523_L1.2-W0.8-LS1.6-RD]  14.71 40.92 90 top
D201  SS14  [SMA_L4.3-W2.6-LS5.2-RD]  96.06 83.84 90 top
D206  LED_0603-R  [LED_0603]  105.22 64.54 90 top
D301  SS34A  [SMA_L4.3-W2.6-LS5.2-RD]  109.6 52.02 270 top
D401  1N4148WT  [SOD-523_L1.2-W0.8-LS1.6-RD]  93.86 121.18 180 top
D403  1N4148WT  [SOD-523_L1.2-W0.8-LS1.6-RD]  91.31 121.18 180 top
H001  PZ254V-12-6P  [PDM_MODULE]  4.73 109.89 180 top
H002  -  [I2S_HT517_STEREO]  54.77 106.71 0 top
H003  PZ254V-12-6P  [CH343_DEBUG]  4.73 96.93 0 top
H004  -  [connector_p10_1.5mm]  -44.55 27.21 0 top
H005  -  [Metal_Detect]  55.78 32.8 180 top
H101  PZ254V-12-6P  [Finger_2*3]  81.27 28.85 0 top
H102  -  [Finger_2*5]  88.76 41.93 90 top
H103  MTP125-1205S1  [HDR-TH_10P-P2.54-V-M-R2-C5-S2.54]  81.26 62.76 270 top
H104  PZ254V-12-6P  [Finger_2*3]  89.34 60.53 90 top
H301  -  [typec-31-e-11]  96.14 57.76 90 top
H302  -  [Single_Pin]  112.98 64.69 0 top
H303  -  [Single_Pin]  112.98 61.47 0 top
H304  -  [Single_Pin]  112.98 53.52 0 top
H305  -  [Single_Pin]  112.98 49.95 0 top
H401  PZ254V-12-6P  [Finger_2*3]  89.02 110.78 0 top
H501  AFC01-S24FCA-00  [FPC-SMD_P0.50-24P_FGS-XJ-H2.0]  102.52 11.94 90 top
H502  -  [Finger_2*9]  107.35 6.7 90 top
H503  -  [connector_p2*9_2.54]  30 119.79 180 top
J001  2.54-2*7P母  [HDR-TH_14P-P2.54-V-F-R2-C7-S2.54-1]  16.54 96.89 270 top
J002  2.54-2*7P母  [HDR-TH_14P-P2.54-V-F-R2-C7-S2.54-1]  30.39 84.82 0 top
J003  2.54-2*7P母  [HDR-TH_14P-P2.54-V-F-R2-C7-S2.54-1]  43.85 96.89 270 top
L001  470uH  [connector_p2_2.0mm]  56.54 19.08 0 top
L201  22uH  [IND-SMD_L4.0-W4.0]  98.15 92.21 180 top
L301  4.7uH  [IND-SMD_L5.8-W5.2]  103.84 51.41 0 top
L501  暖白3528LED灯珠  [LED-SMD_L3.6-W2.9-R-RD]  85.38 20.57 180 top
L502  暖白3528LED灯珠  [LED-SMD_L3.6-W2.9-R-RD]  85.38 3.05 180 top
NOREF  -  [Pad_e163]  14 19.5 0 top
NOREF#2  -  [Pad_e160]  14 119.5 0 top
NOREF#3  -  [Pad_e162]  46 119.5 180 top
NOREF#4  -  [Pad_e164]  46 19.5 90 top
Q001  SS8550  [SOT-23-3_L2.9-W1.4-P1.90-LS2.6-BR]  9.39 56.4 180 top
Q002  AO4407C  [SOP-8_L4.9-W3.9-P1.27-LS6.0-BL]  10.48 34.85 0 top
Q003  SS8050  [SOT-23-3_L2.9-W1.3-P1.90-LS2.4-BR]  14.92 36.53 90 top
Q101  AO3407  [SOT-23-3_L2.9-W1.3-P1.90-LS2.4-BR]  83.55 36.22 180 top
Q102  SS8050  [SOT-23-3_L2.9-W1.3-P1.90-LS2.4-BR]  80.38 32.79 0 top
Q103  SS8050  [SOT-23-3_L2.9-W1.3-P1.90-LS2.4-BR]  85.83 65.17 180 top
Q104  SS8050  [SOT-23-3_L2.9-W1.3-P1.90-LS2.4-BR]  85.83 61.87 180 top
Q401  MMBT3904  [SOT-23-3_L2.9-W1.3-P1.90-LS2.4-BR]  96.46 114.5 180 top
Q402  MMBT3906-7-F  [SOT-23-3_L2.9-W1.6-P1.90-LS2.8-BR]  99.58 117.91 270 top
Q403  AO3402A  [SOT-23-3_L2.9-W1.3-P1.90-LS2.4-BR]  96.36 117.96 90 top
Q404  AO3401A  [SOT-23_L2.9-W1.3-P1.90-LS2.4-BR]  83.61 119.85 270 top
Q405  MMBT3904  [SOT-23-3_L2.9-W1.3-P1.90-LS2.4-BR]  83.61 114.7 270 top
Q501  AO3404A  [SOT-23_L2.9-W1.3-P1.90-LS2.4-BR]  94.52 20.07 0 bottom
R001  10K  [R0603]  16.92 107.88 270 top
R002  10K  [R0603]  6.99 56.35 90 top
R003  10K  [R0603]  14 33.22 90 top
R004  10K  [R0603]  15.07 39.03 180 top
R005  10K  [R0603]  11.42 107.88 90 top
R006  10K  [R0603]  9.93 107.88 90 top
R101  10K  [R0603]  80.88 36.22 270 top
R102  10R  [R0603]  79.36 36.22 90 top
R103  1K  [R0603]  83.3 32.66 90 top
R104  NC  [R0603]  80.38 39.77 270 top
R105  NC  [R0603]  81.9 39.77 270 top
R106  NC  [R0603]  80.38 48.41 270 top
R107  NC  [R0603]  81.9 48.41 270 top
R108  NC  [R0603]  85.58 59.21 0 top
R109  NC  [R0603]  85.58 57.43 0 top
R201  10K  [R0603]  101.17 102.13 0 top
R202  10K  [R0603]  101.17 99.09 0 top
R203  10K  [R0603]  101.17 100.61 0 top
R204  10K  [R0603]  101.17 97.57 0 top
R205  10K  [R0603]  97.74 79.41 180 top
R206  10K  [R0603]  86.06 80.12 90 top
R207  10K  [R0603]  84.63 83.18 90 top
R208  10K  [R0603]  84.56 80.12 90 top
R209  10K  [R0603]  83.1 83.18 90 top
R210  10K  [R0603]  83.05 80.12 90 top
R211  10K  [R0603]  81.57 83.18 90 top
R212  10K  [R0603]  81.55 80.12 90 top
R213  10K  [R0603]  80.04 83.18 90 top
R214  10K  [R0603]  80.05 80.12 90 top
R215  10K  [R0603]  100.96 74.41 0 top
R216  10K  [R0603]  100.96 72.93 0 top
R217  10K  [R0603]  100.96 71.45 0 top
R218  10K  [R0603]  100.96 78.85 0 top
R219  10K  [R0603]  100.96 77.37 0 top
R220  10K  [R0603]  100.96 75.89 0 top
R221  10K  [R0603]  100.96 83.29 0 top
R222  10K  [R0603]  100.96 81.81 0 top
R223  10K  [R0603]  100.96 80.33 0 top
R224  10K  [R0603]  86.06 83.18 90 top
R225  10K  [R0603]  100.96 84.76 180 top
R301  1K  [R0603]  103.49 64.5 270 top
R302  10K  [R0603]  106.85 64.5 270 top
R303  10K  [R0603]  108.28 64.5 270 top
R401  10K  [R0603]  94.07 114.39 90 top
R402  10K  [R0603]  100.44 114.44 90 top
R403  10K  [R0603]  98.96 114.44 90 top
R404  10K  [R0603]  99.68 120.82 0 top
R405  10K  [R0603]  96.72 120.82 0 top
R406  10K  [R0603]  92.49 117.35 90 top
R407  10K  [R0603]  94.02 117.35 270 top
R408  10K  [R0603]  89.73 113.63 0 top
R409  10K  [R0603]  92.44 114.39 270 top
R410  10K  [R0603]  88.51 120.72 0 top
R411  10K  [R0603]  83.61 117.2 180 top
R412  10K  [R0603]  86.72 113.63 180 top
R413  10K  [R0603]  86.21 119.29 90 top
R414  10K  [R0603]  86.26 116.28 90 top
R415  10K  [R0603]  101.9 64.5 270 top
R416  10K  [R0603]  100.32 64.5 270 top
R501  1K  [R0603]  92.75 13.97 270 bottom
R502  1K  [R0603]  89.7 20.19 90 bottom
R503  1K  [R0603]  91.73 20.19 270 bottom
R504  1K  [R0603]  97.32 20.07 90 bottom
R505  1K  [R0603]  98.97 20.07 270 bottom
R506  1K  [R0603]  100.36 13.46 180 bottom
S001  TC-1102N-C-A-B  [SW-TH_TC-1102N-C-A-B]  5.11 118.52 180 top
S002  TC-1102N-C-A-B  [SW-TH_TC-1102N-C-A-B]  5.36 20.48 0 top
S003  TC-1102N-C-A-B  [SW-TH_TC-1102N-C-A-B]  56.17 91.69 90 top
S004  TC-1102N-C-A-B  [SW-TH_TC-1102N-C-A-B]  56.17 82.17 90 top
SPK1  B2B-ZR(LF)(SN)  [CONN-TH_B2B-ZR-LF-SN]  52.6 120.49 180 top
SPK2  B2B-ZR(LF)(SN)  [CONN-TH_B2B-ZR-LF-SN]  57.3 120.49 180 top
U001  -  [ESP32-S3-WROOM-1U]  30.26 98.67 0 top
U002  -  [GPBA02B-C]  32.03 70.77 0 top
U003  ME6206A33PG  [SOT-89-3_L4.5-W2.5-P1.50-LS4.2-BR]  11.15 61.04 270 top
U004  -  [CX8823_MO]  18.57 60.48 0 top
U101  -  [SD18OB261-104]  85.96 31.9 0 top
U102  HT517  [QFN-16_L3.0-W3.0-P0.50-TL-EP1.7]  80.83 44.29 90 top
U103  HT517  [QFN-16_L3.0-W3.0-P0.50-TL-EP1.7]  80.83 52.92 90 top
U201  TF-01A  [TF-SMD_TF-01A]  88.51 93.74 270 top
U202  -  [FPC_28P_0.5]  88.87 74.05 0 top
U203  MT9201  [SOT-23-6_L2.9-W1.6-P0.95-LS2.8-BR]  100.39 87.97 180 top
U204  ME6206A33PG  [SOT-89-3_L4.5-W2.5-P1.50-LS4.2-BR]  90.96 82.82 180 top
U205  -  [connector_p10_1.5mm]  89.27 105.57 180 top
U301  CS5095E  [ESOP-8_L4.9-W3.9-P1.27-LS6.0-BL-EP]  105.21 58.48 0 top
U401  LM321-TR  [SOT-23-5_L3.0-W1.7-P0.95-LS2.8-BR]  89.27 118.22 0 top
U501  ME6206A33PG  [SOT-89-3_L4.5-W2.5-P1.50-LS4.2-BR]  98.71 3.5 90 bottom
U502  XC6206-2.8V  [SOT-23-3_L2.9-W1.6-P1.90-LS2.8-BR]  92.36 2.67 90 bottom
U503  XC6206-1.2V  [SOT-23-3_L2.9-W1.6-P1.90-LS2.8-BR]  86.39 2.41 90 bottom
X501  24MHz  [OSC-SMD_4P-L3.2-W2.5-BL]  95.92 13.97 0 bottom

## Footprints (pads in the part's own frame, mm; a bottom-side part is the same pattern mirrored in y, then rotated)
C0603
  rect 0.8x0.9 smd: 1(-0.7,0) 2(0.7,0)
C0805
  rect 1.41x1.35 smd: 1(-1,0) 2(1,0)
CAP-SMD_BD6.3-L6.6-W6.6-LS7.2-R-RD
  rect 3.26x1.15 smd: 1(2.555,0) 2(-2.555,0)
CH343_DEBUG
  rect 1.6x1.6 hole 0.914: 1(-1.778,2.54) 2(1.778,2.54) 3(-1.778,0) 4(1.778,0) 5(-1.778,-2.54) 6(1.778,-2.54)
CONN-TH_B2B-ZR-LF-SN
  rect 1.2x1.2 hole 0.8: 1(0.75,0.001)
  round 1.2 hole 0.8: 2(-0.75,-0.001)
connector_p2*9_2.54
  rect 1.524x1.524 hole 1: 1(-9,-1)
  round 1.524 hole 1: 2(-9,1) 3(-7,-1) 4(-7,1) 5(-5,-1) 6(-5,1) 7(-3,-1) 8(-3,1) 9(-1,-1) 10(-1,1) 11(1,-1) 12(1,1) 13(3,-1) 14(3,1) 15(5,-1) 16(5,1) 17(7,-1) 18(7,1)
connector_p2_2.0mm
  round 1.6 hole 0.899: 1(1.001,0.004) 2(-1.001,0.004)
connector_p10_1.5mm
  rect 1.1x1.1 hole 0.701: 1(-6.749,0.001)
  round 1.1 hole 0.701: 2(-5.25,0.001) 3(-3.749,0.001) 4(-2.251,0.001) 5(-0.75,0.001) 6(0.75,0.001) 7(2.251,0.001) 8(3.749,0.001) 9(5.25,0.001) 10(6.752,0.001)
CX8823_MO
  rect 5x4.5 smd: 1(1.27,-3.75) 2(25.73,-3.75) 3(1.27,-11.25) 4(25.73,-11.25)
ESOP-8_L4.9-W3.9-P1.27-LS6.0-BL-EP
  rect 0.6x1.2 smd: 1(-1.905,-2.909) 2(-0.635,-2.909) 3(0.635,-2.909) 4(1.905,-2.909) 5(1.905,2.909) 6(0.635,2.909) 7(-0.635,2.909) 8(-1.905,2.909)
  rect 3.3x2.4 smd: 9(0,0)
ESP32-S3-WROOM-1U
  rect 1.5x0.9 smd: 1(-8.877,8.895) 2(-8.877,7.625) 3(-8.877,6.355) 4(-8.877,5.085) 5(-8.877,3.815) 6(-8.877,2.545) 7(-8.877,1.275) 8(-8.877,0.005) 9(-8.877,-1.265) 10(-8.877,-2.535) 11(-8.877,-3.805) 12(-8.877,-5.075) 13(-8.877,-6.345) 14(-8.877,-7.615) 27(8.623,-7.615) 28(8.623,-6.345) 29(8.623,-5.075) 30(8.623,-3.805) 31(8.623,-2.535) 32(8.623,-1.265) 33(8.623,0.005) 34(8.623,1.275) 35(8.623,2.545) 36(8.623,3.815) 37(8.623,5.085) 38(8.623,6.355) 39(8.623,7.625) 40(8.623,8.895)
  rect 0.9x1.5 smd: 15(-7.112,-8.895) 16(-5.842,-8.895) 17(-4.572,-8.895) 18(-3.302,-8.895) 19(-2.032,-8.895) 20(-0.762,-8.895) 21(0.508,-8.895) 22(1.778,-8.895) 23(3.048,-8.895) 24(4.318,-8.895) 25(5.588,-8.895) 26(6.858,-8.865)
  rect 0.9x0.9 smd: 41(-3.027,2.575) 41(-3.027,1.175) 41(-3.027,-0.225) 41(-1.627,2.575) 41(-1.627,1.175) 41(-1.627,-0.225) 41(-0.227,2.575) 41(-0.227,1.175) 41(-0.227,-0.225)
Finger_2*3
  rect 1.6x2.5 smd: 1(0,0) 3(2.54,0) 5(5.08,0)
  rect 1.6x2.5 smd far side: 2(0,-0.006) 4(2.54,-0.006) 6(5.08,-0.006)
Finger_2*5
  rect 1.6x2.5 smd: 1(-2.54,0.003) 3(0,0.003) 5(2.54,0.003) 7(5.08,0.003) 9(7.62,0.003)
  rect 1.6x2.5 smd far side: 2(-2.54,-0.003) 4(0,-0.003) 6(2.54,-0.003) 8(5.08,-0.003) 10(7.62,-0.003)
Finger_2*9
  rect 1.6x2.5 smd: 1(-5.08,0.006) 3(-2.54,0.006) 5(0,0.006) 7(2.54,0.006) 9(5.08,0.006) 11(7.62,0) 13(10.16,0) 15(12.7,0) 17(15.24,0)
  rect 1.6x2.5 smd far side: 2(-5.08,0) 4(-2.54,0) 6(0,0) 8(2.54,0) 10(5.08,0) 12(7.62,0) 14(10.16,-0.006) 16(12.7,-0.006) 18(15.24,-0.006)
FPC-SMD_P0.50-24P_FGS-XJ-H2.0
  rect 0.3x1.3 smd: 1(-5.748,-1.3) 2(-5.248,-1.3) 3(-4.748,-1.3) 4(-4.248,-1.3) 5(-3.748,-1.3) 6(-3.248,-1.3) 7(-2.748,-1.3) 8(-2.248,-1.3) 9(-1.748,-1.3) 10(-1.248,-1.3) 11(-0.748,-1.3) 12(-0.248,-1.3) 13(0.252,-1.3) 14(0.752,-1.3) 15(1.252,-1.3) 16(1.752,-1.3) 17(2.252,-1.3) 18(2.752,-1.3) 19(3.252,-1.3) 20(3.752,-1.3) 21(4.252,-1.3) 22(4.752,-1.3) 23(5.252,-1.3) 24(5.752,-1.3)
  rect 2x1.6 smd: 25(7.45,1.3) 26(-7.45,1.3)
FPC_28P_0.5
  rect 1.8x2.2 smd: (-8.4,0) (8.4,0)
  rect 0.3x1.3 smd: 1(6.75,2.497) 2(6.25,2.497) 3(5.75,2.497) 4(5.25,2.497) 5(4.75,2.497) 6(4.25,2.497) 7(3.75,2.497) 8(3.25,2.497) 9(2.75,2.497) 10(2.25,2.497) 11(1.75,2.497) 12(1.25,2.497) 13(0.75,2.497) 14(0.25,2.497) 15(-0.25,2.497) 16(-0.75,2.497) 17(-1.25,2.497) 18(-1.75,2.497) 19(-2.25,2.497) 20(-2.75,2.497) 21(-3.25,2.497) 22(-3.75,2.497) 23(-4.25,2.497) 24(-4.75,2.497) 25(-5.25,2.497) 26(-5.75,2.497) 27(-6.25,2.497) 28(-6.75,2.497)
GPBA02B-C
  oval 1.1x2 smd: 2(-6.042,6.993) 35(-4.341,6.983)
  oval 2x1.1 smd: 3(-7.862,5.003) 4(-7.862,3.503) 5(-7.862,2.003) 25(5.519,2.003) 26(5.519,3.503) 27(5.519,5.003)
  oval 2x1 smd: 6(-7.862,0.503) 7(-7.862,-0.997) 8(-7.862,-2.497) 9(-7.862,-3.997) 10(-7.862,-5.497) 20(5.519,-5.497) 21(5.519,-3.997) 22(5.519,-2.497) 23(5.519,-0.997) 24(5.519,0.503)
  oval 1x2 smd: 11(-5.242,-6.417) 12(-3.741,-6.417) 13(-2.241,-6.417) 14(-0.742,-6.417) 15(0.758,-6.417) 17(2.259,-6.417) 30(1.659,7.006) 31(0.159,7.003) 32(-1.341,6.973) 33(-2.821,6.983)
HDR-TH_10P-P2.54-V-M-R2-C5-S2.54
  rect 1.7x1.7 hole 1.1: 1(-5.08,-1.27)
  round 1.7 hole 1.1: 2(-5.08,1.27) 3(-2.54,-1.27) 4(-2.54,1.27) 5(0,-1.27) 6(0,1.27) 7(2.54,-1.27) 8(2.54,1.27) 9(5.08,-1.27) 10(5.08,1.27)
HDR-TH_14P-P2.54-V-F-R2-C7-S2.54-1
  rect 1.801x1.801 hole 1.1: 1(-7.62,-1.27)
  round 1.801 hole 1.1: 2(-7.62,1.27) 3(-5.08,-1.27) 4(-5.08,1.27) 5(-2.54,-1.27) 6(-2.54,1.27) 7(0,-1.27) 8(0,1.27) 9(2.54,-1.27) 10(2.54,1.27) 11(5.08,-1.27) 12(5.08,1.27) 13(7.62,-1.27) 14(7.62,1.27)
I2S_HT517_STEREO
  rect 1.6x1.6 hole 0.914: 1(-1.758,5.08) 2(1.798,5.08) 3(-1.758,2.54) 4(1.798,2.54) 5(-1.758,0) 6(1.798,0) 7(-1.758,-2.54) 8(1.798,-2.54) 9(-1.758,-5.08) 10(1.798,-5.08)
IND-SMD_L4.0-W4.0
  rect 1.6x3.5 smd: 1(-1.6,0) 2(1.6,0)
IND-SMD_L5.8-W5.2
  rect 3x5.5 smd: 1(2.325,0) 2(-2.325,0)
LED-SMD_L3.6-W2.9-R-RD
  rect 1.785x3.024 smd: 1(1.593,0) 2(-1.593,0)
LED_0603
  rect 0.8x0.8 smd: 1(-0.851,-0.01) 2(0.75,-0.005)
Metal_Detect
  rect 1.6x1.6 hole 0.914: 1(-230.251,2.54) 2(-226.695,2.54) 3(-230.251,0) 4(-226.695,0) 5(-230.251,-2.54) 6(-226.695,-2.54)
OSC-SMD_4P-L3.2-W2.5-BL
  rect 1.4x1.2 smd: 1(-1.1,-0.875) 2(1.1,-0.875) 3(1.1,0.875) 4(-1.1,0.875)
Pad_e160
  round 5 hole 3.2: (0,0)
Pad_e162
  round 5 hole 3.2: (0,0)
Pad_e163
  round 5 hole 3.2: (0,0)
Pad_e164
  round 5 hole 3.2: (0,0)
PDM_MODULE
  rect 1.6x1.6 hole 0.914: 1(-0.778,-0.96) 2(2.778,-0.96) 3(-0.778,-3.5) 4(2.778,-3.5) 5(-0.778,-6.04) 6(2.778,-6.04)
QFN-16_L3.0-W3.0-P0.50-TL-EP1.7
  oval 0.851x0.28 smd: 1(-1.501,0.75) 2(-1.501,0.249) 3(-1.501,-0.249) 4(-1.501,-0.75) 9(1.501,-0.75) 10(1.501,-0.249) 11(1.501,0.249) 12(1.501,0.75)
  oval 0.28x0.851 smd: 5(-0.75,-1.501) 6(-0.249,-1.501) 7(0.249,-1.501) 8(0.75,-1.501) 13(0.75,1.501) 14(0.249,1.501) 15(-0.249,1.501) 16(-0.75,1.501)
  custom 1.702x1.702 smd: 17(0,0)
R0603
  rect 0.806x0.864 smd: 1(-0.753,0) 2(0.753,0)
SD18OB261-104
  rect 0.52x0.73 smd: 1(-0.673,-0.835) 2(0.146,-0.835) 4(0.146,0.835) 5(-0.673,0.835)
  round 0.076 smd: 3(0.768,-0.005) 3(1.392,0.629) 3(1.402,-0.629) 3(2.026,0.005)
Single_Pin
  round 2 hole 1.2: 1(0,0)
SMA_L4.3-W2.6-LS5.2-RD
  rect 2x2 smd: 1(-2.2,0) 2(2.2,0)
SOD-523_L1.2-W0.8-LS1.6-RD
  rect 0.93x0.36 smd: 1(-0.635,0) 2(0.635,0)
SOP-8_L4.9-W3.9-P1.27-LS6.0-BL
  oval 0.63x1.865 smd: 1(-1.905,-2.683) 2(-0.635,-2.683) 3(0.635,-2.683) 4(1.905,-2.683) 5(1.905,2.683) 6(0.635,2.683) 7(-0.635,2.683) 8(-1.905,2.683)
SOT-23-3_L2.9-W1.3-P1.90-LS2.4-BR
  rect 1.25x0.7 smd: 1(1,-0.95) 2(1,0.95) 3(-1,0)
SOT-23-3_L2.9-W1.4-P1.90-LS2.6-BR
  rect 0.91x0.6 smd: 1(1.055,-0.955) 2(1.055,0.955) 3(-1.055,0)
SOT-23-3_L2.9-W1.6-P1.90-LS2.8-BR
  rect 1.07x0.6 smd: 1(1.235,-0.95) 2(1.235,0.95) 3(-1.235,0)
SOT-23-5_L3.0-W1.7-P0.95-LS2.8-BR
  rect 1x0.6 smd: 1(1.3,-0.95) 2(1.3,0) 3(1.3,0.95) 4(-1.3,0.95) 5(-1.3,-0.95)
SOT-23-6_L2.9-W1.6-P0.95-LS2.8-BR
  rect 1x0.55 smd: 1(1.4,-0.95) 2(1.4,0) 3(1.4,0.95) 4(-1.4,0.95) 5(-1.4,0) 6(-1.4,-0.95)
SOT-23_L2.9-W1.3-P1.90-LS2.4-BR
  rect 1x0.8 smd: 1(1.15,-0.95) 2(1.15,0.95) 3(-1.15,0)
SOT-89-3_L4.5-W2.5-P1.50-LS4.2-BR
  rect 1.575x0.672 smd: 1(1.356,-1.5) 3(1.356,1.5)
  custom 5.377x1.9 smd: 2(-1.356,0)
SW-TH_TC-1102N-C-A-B
  round 1.801 hole 1.199: 1(-2.251,-1.349) 2(2.251,-1.349)
  round 2.2 hole 1.501: 3(-3.5,1.351) 4(3.5,1.351)
TF-SMD_TF-01A
  rect 0.6x1.3 smd: 1(2.3,5.276) 2(1.2,5.276) 3(0.101,5.276) 4(-1,5.276) 5(-2.099,5.276) 6(-3.2,5.276) 7(-4.3,5.276) 8(-5.399,5.276) 9(-6.5,5.276)
  rect 1.2x1.4 smd: 10(-7.599,4.426) 13(7.08,4.426)
  rect 1.2x2 smd: 11(-7.76,-5.276) 12(7.76,-5.276)
typec-31-e-11
  oval 1.001x1.501 hole 0.914x0.96: 1(-2.751,-0.029) 6(2.748,-0.029)
  oval 0.899x1.501 hole 0.8x0.96: 2(-1.522,-0.029) 5(1.519,-0.029)
  oval 0.711x1.501 hole 0.6x0.8: 3(-0.5,-0.029) 4(0.5,-0.029)
  oval 1.001x1.999 hole 0.6x1.6: 7(-4.321,-0.4) 8(4.321,-0.4)

## Nets
As in the schematic, except:
ESP_IO35: H004.4 J003.11 U001.28
ESP_IO36: H004.3 J003.10 U001.29

Pads without a net: H001 4; H101 4; H501 1 23 24; S002 3 4; U002 7 8 9 15 20 21 22 23 24 25 26 27; U102 5 6 12 13; U103 5 6 12 13; U201 1 8 9

## Text on the board
Top Silkscreen Layer: B- | SPI4 | 8080 | SPI3 | B+
